# EAGLE design homeboard11 (EAGLE 6.0)
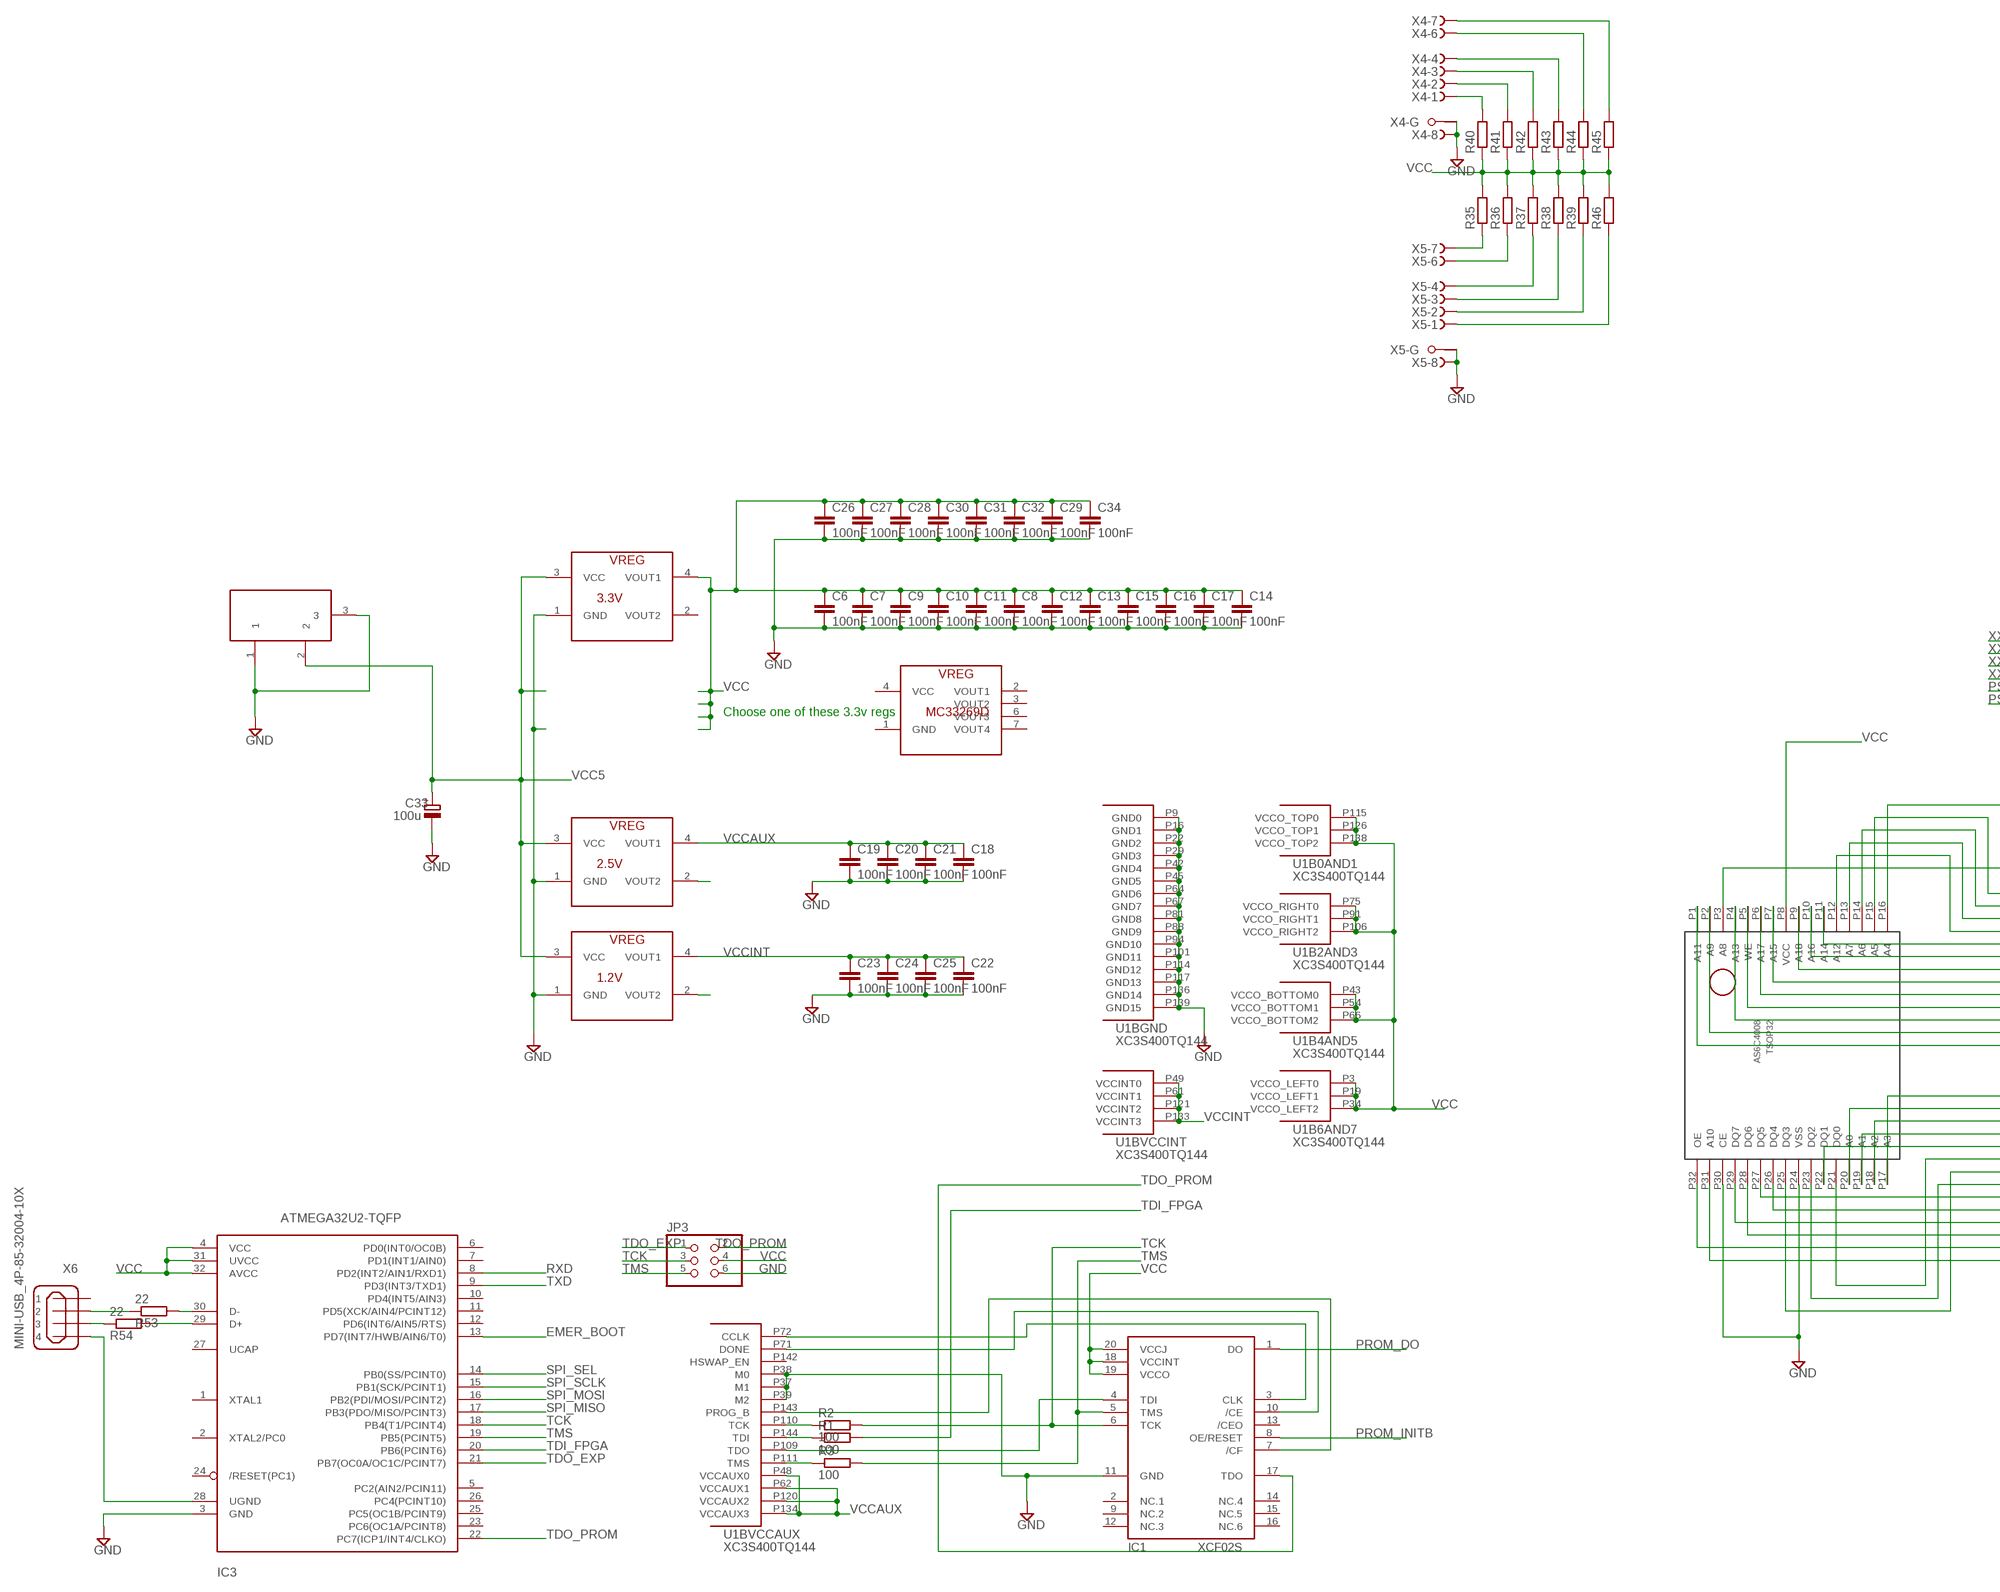
[diagram p0: schematic, sheet 1, part 1 of 3]
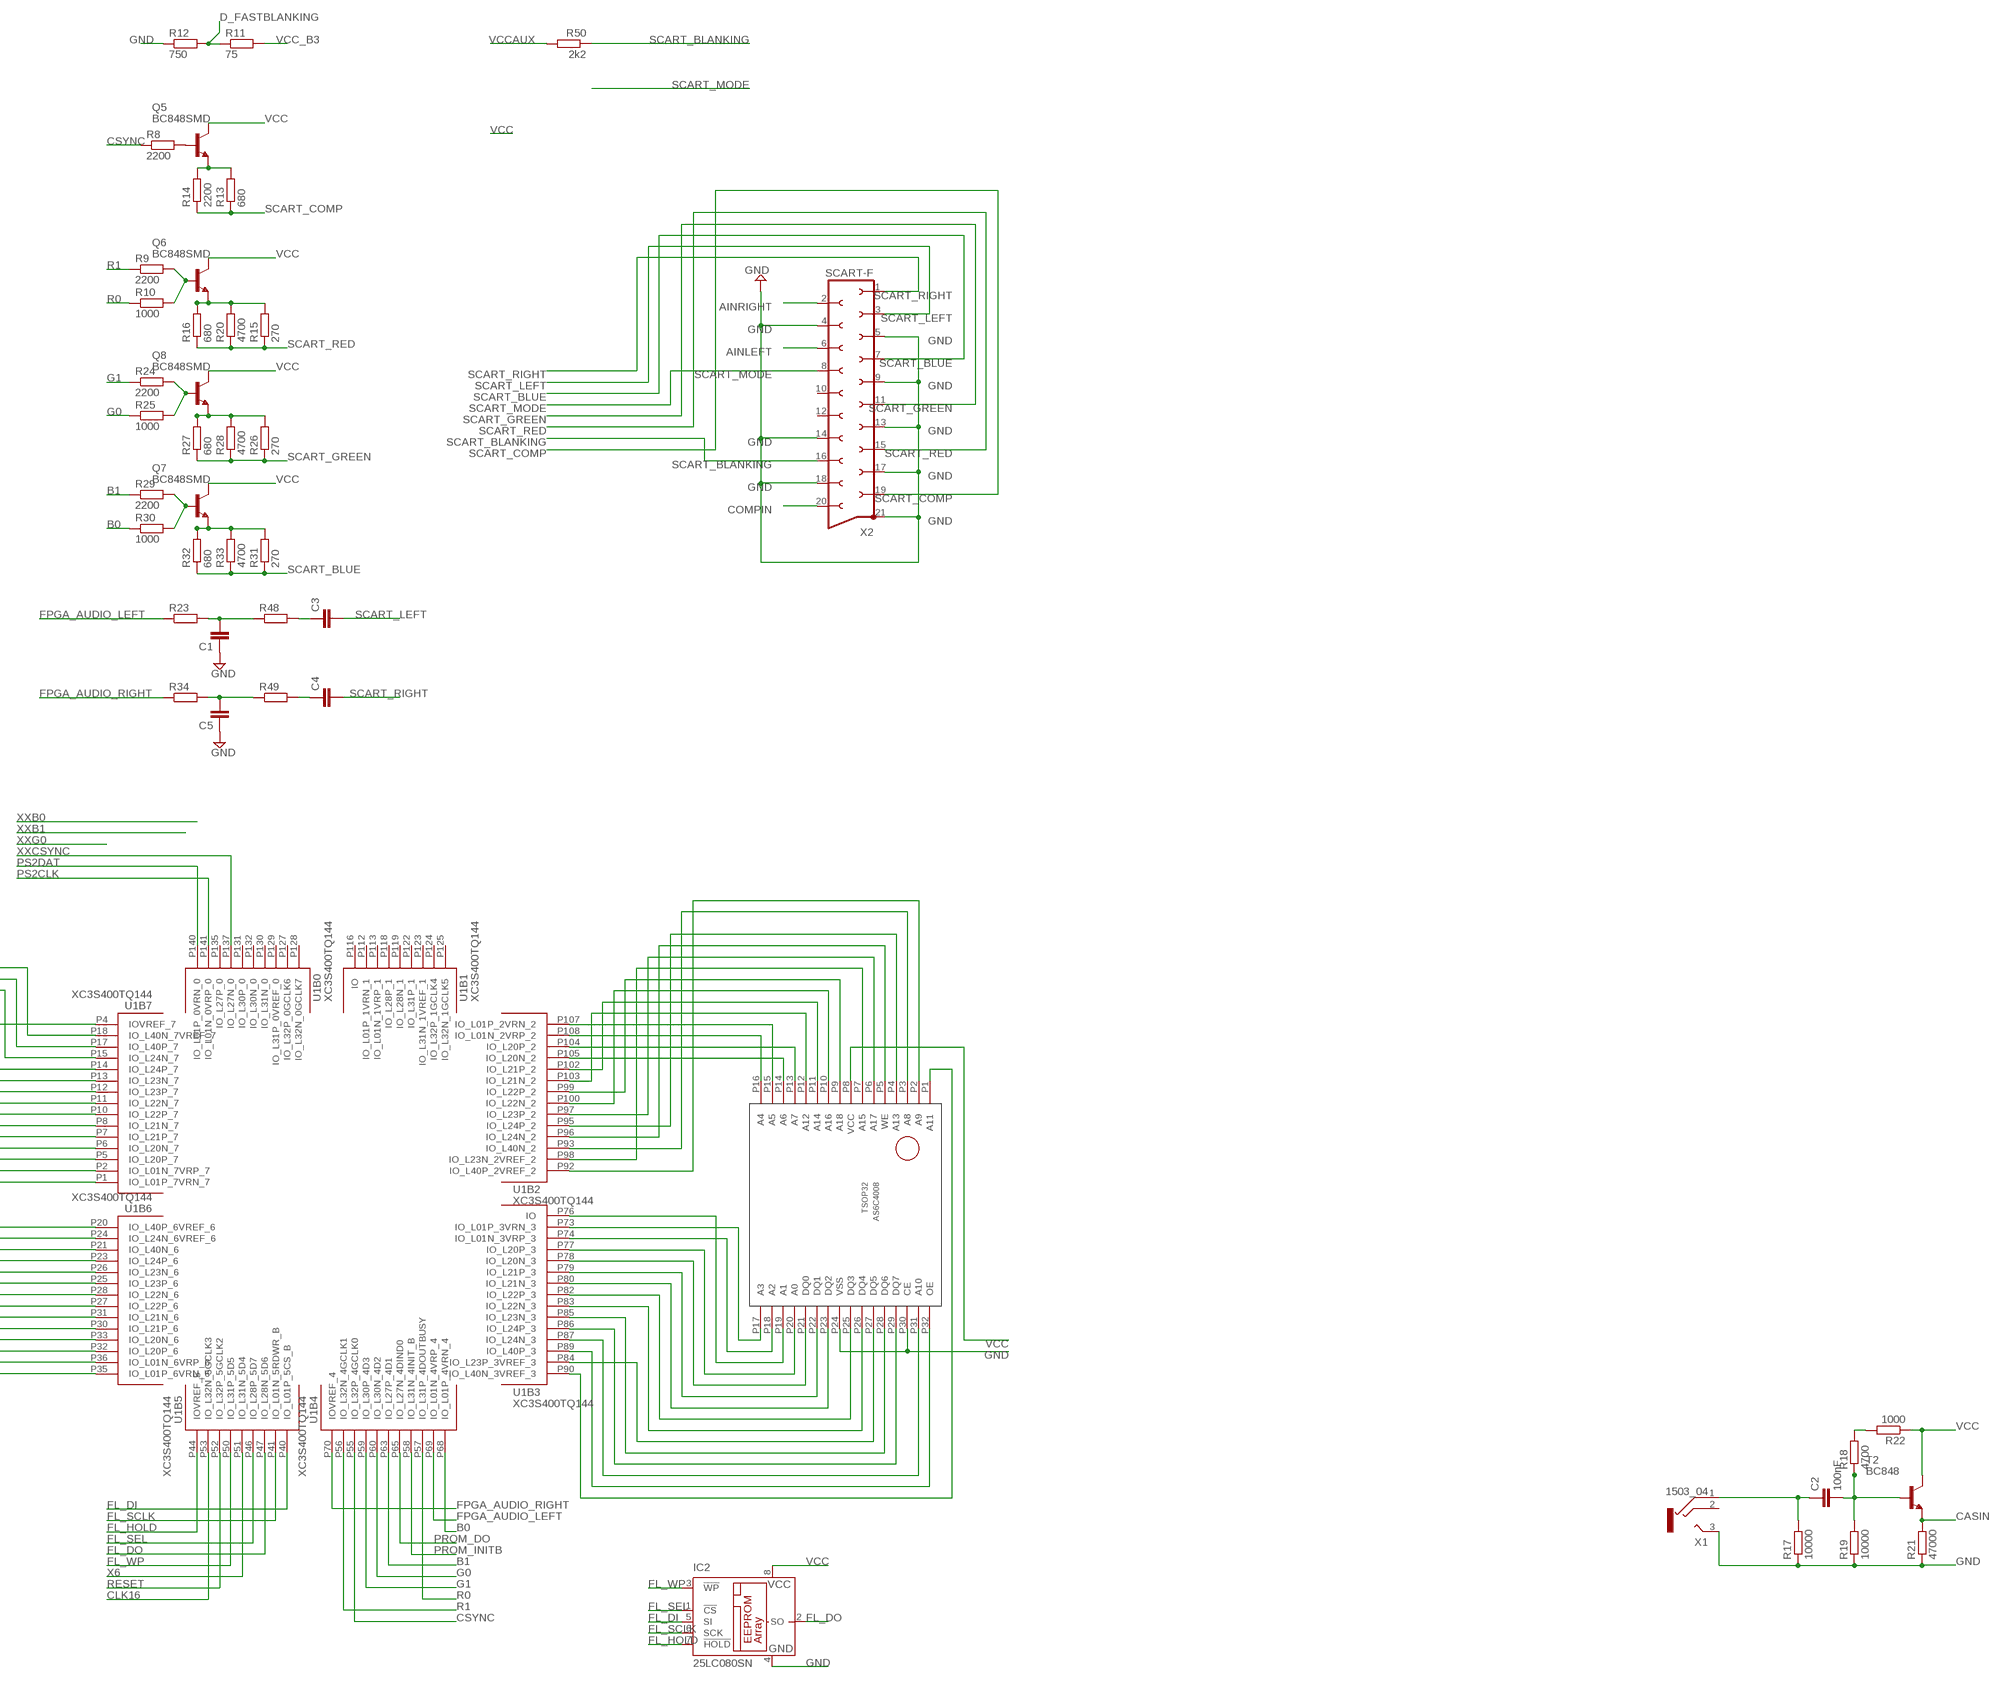
[diagram p1: schematic, sheet 1, part 2 of 3]
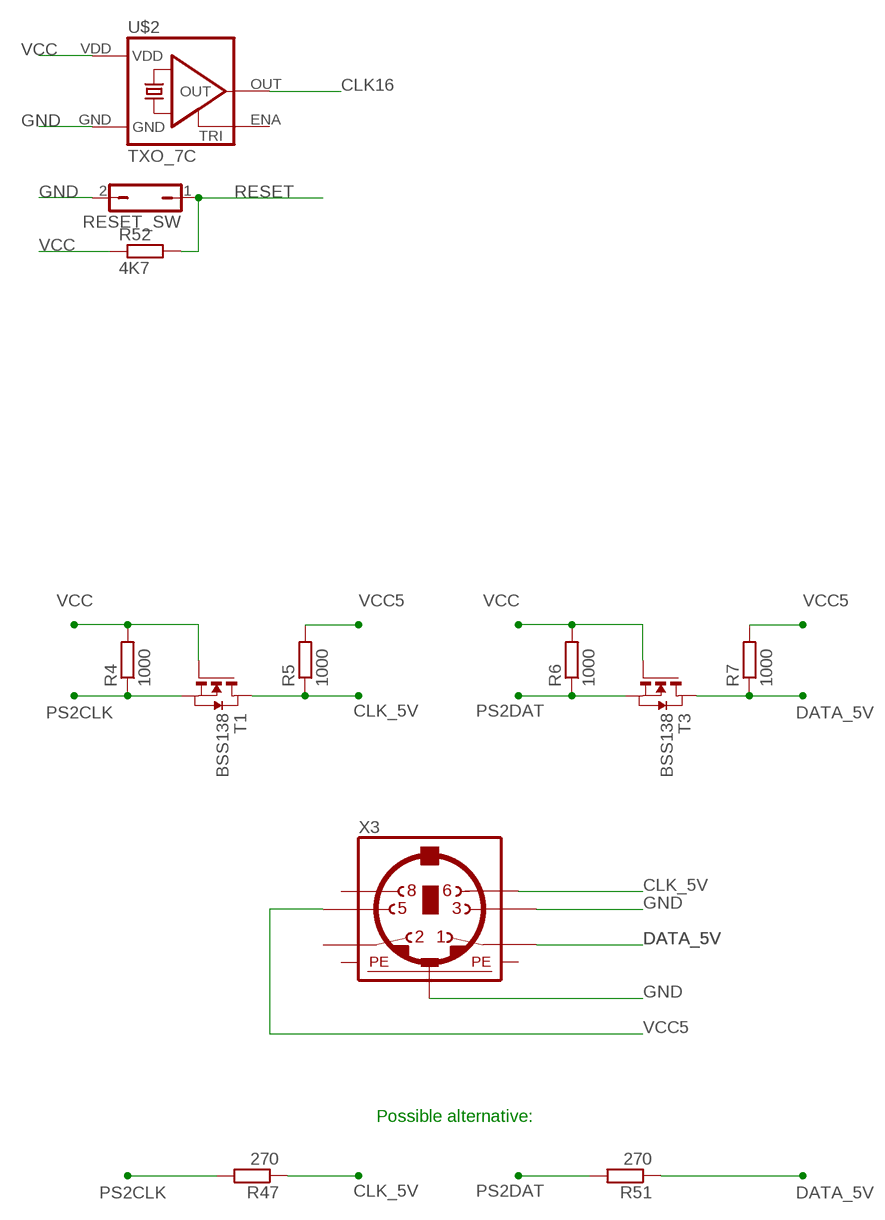
[diagram p2: schematic, sheet 1, part 3 of 3]

## Parts
C1  C-EUC0603  [C0603]
C2  100nF  C-EUC0603  [C0603]
C3  C-EUC0603  [C0603]
C4  C-EUC0603  [C0603]
C5  C-EUC0603  [C0603]
C6  100nF  C-EUC0603  [C0603]
C7  100nF  C-EUC0603  [C0603]
C8  100nF  C-EUC0603  [C0603]
C9  100nF  C-EUC0603  [C0603]
C10  100nF  C-EUC0603  [C0603]
C11  100nF  C-EUC0603  [C0603]
C12  100nF  C-EUC0603  [C0603]
C13  100nF  C-EUC0603  [C0603]
C14  100nF  C-EUC0603  [C0603]
C15  100nF  C-EUC0603  [C0603]
C16  100nF  C-EUC0603  [C0603]
C17  100nF  C-EUC0603  [C0603]
C18  100nF  C-EUC0603  [C0603]
C19  100nF  C-EUC0603  [C0603]
C20  100nF  C-EUC0603  [C0603]
C21  100nF  C-EUC0603  [C0603]
C22  100nF  C-EUC0603  [C0603]
C23  100nF  C-EUC0603  [C0603]
C24  100nF  C-EUC0603  [C0603]
C25  100nF  C-EUC0603  [C0603]
C26  100nF  C-EUC0603  [C0603]
C27  100nF  C-EUC0603  [C0603]
C28  100nF  C-EUC0603  [C0603]
C29  100nF  C-EUC0603  [C0603]
C30  100nF  C-EUC0603  [C0603]
C31  100nF  C-EUC0603  [C0603]
C32  100nF  C-EUC0603  [C0603]
C33  100u  CPOL-EUD  [PANASONIC_D]
C34  100nF  C-EUC0603  [C0603]
IC1  XCF02S  [VO20]
IC2  25LC080SN  [SO-08]
IC3  ATMEGA32U2-TQFP  [TQFP32-08]
JP3  PINHD-2X3  [2X03]
Q5  BC848SMD  [SOT23]
Q6  BC848SMD  [SOT23]
Q7  BC848SMD  [SOT23]
Q8  BC848SMD  [SOT23]
R1  100  R-EU_R0805  [R0805]
R2  100  R-EU_R0805  [R0805]
R3  100  R-EU_R0805  [R0805]
R4  1000  R-EU_R0805  [R0805]
R5  1000  R-EU_R0805  [R0805]
R6  1000  R-EU_R0805  [R0805]
R7  1000  R-EU_R0805  [R0805]
R8  2200  R-EU_R0805  [R0805]
R9  2200  R-EU_R0805  [R0805]
R10  1000  R-EU_R0805  [R0805]
R11  75  R-EU_R0805  [R0805]
R12  750  R-EU_R0805  [R0805]
R13  680  R-EU_R0805  [R0805]
R14  2200  R-EU_R0805  [R0805]
R15  270  R-EU_R0805  [R0805]
R16  680  R-EU_R0805  [R0805]
R17  10000  R-EU_R0805  [R0805]
R18  4700  R-EU_R0805  [R0805]
R19  10000  R-EU_R0805  [R0805]
R20  4700  R-EU_R0805  [R0805]
R21  47000  R-EU_R0805  [R0805]
R22  1000  R-EU_R0805  [R0805]
R23  R-EU_M0805  [M0805]
R24  2200  R-EU_R0805  [R0805]
R25  1000  R-EU_R0805  [R0805]
R26  270  R-EU_R0805  [R0805]
R27  680  R-EU_R0805  [R0805]
R28  4700  R-EU_R0805  [R0805]
R29  2200  R-EU_R0805  [R0805]
R30  1000  R-EU_R0805  [R0805]
R31  270  R-EU_R0805  [R0805]
R32  680  R-EU_R0805  [R0805]
R33  4700  R-EU_R0805  [R0805]
R34  R-EU_M0805  [M0805]
R35  R-EU_M0805  [M0805]
R36  R-EU_M0805  [M0805]
R37  R-EU_M0805  [M0805]
R38  R-EU_M0805  [M0805]
R39  R-EU_M0805  [M0805]
R40  R-EU_M0805  [M0805]
R41  R-EU_M0805  [M0805]
R42  R-EU_M0805  [M0805]
R43  R-EU_M0805  [M0805]
R44  R-EU_M0805  [M0805]
R45  R-EU_M0805  [M0805]
R46  R-EU_M0805  [M0805]
R47  270  R-EU_R0805  [R0805]
R48  R-EU_M0805  [M0805]
R49  R-EU_M0805  [M0805]
R50  2k2  R-EU_M0805  [M0805]
R51  270  R-EU_R0805  [R0805]
R52  4K7  R-EU_M0805  [M0805]
R53  22  R-EU_R0805  [R0805]
R54  22  R-EU_R0805  [R0805]
REG1.2  1.2V  NX1117  [SOT223]
REG2.5  2.5V  NX1117  [SOT223]
RESET_SW  JP1Q  [JP1]
T1  BSS138  NMOSSOT23  [SOT-23]
T2  BC848  [SOT23]
T3  BSS138  NMOSSOT23  [SOT-23]
U1  XC3S400TQ144  [TQ144]
U$1  AS6C4008  [TSOP32]
U$2  TXO_7C  [OSC_7C]
U$4  3.3V  NX1117  [SOT223]
U$5  MC33269D  [SO8]
U$6  AS6C4008  [TSOP32]
X1  1503_04  [1503_04]
X2  SCART-F  [SCART-F]
X3  MINI_DIN_6  [M_DIN6]
X4  F09HPS  [F09HP]
X5  F09HPS  [F09HP]
X6  MINI-USB_4P-85-32004-10X  [85-32004-10X]
X8  DC21MMX  [DC-21MM]

## Nets
AINLEFT: X2.6
AINRIGHT: X2.2
B0: R30.1 U1.P68(B4:IO_L01P_4VRN_4)
B1: R29.1 U1.P63(B4:IO_L27P_4D1)
CASIN: R21.2 T2.2(E)
CLK16: U1.P53(B5:IO_L32N_5GCLK3) U$2.OUT
CLK_5V: R5.1 R47.1 T1.1(D) X3.6
COMPIN: X2.20
CSYNC: R8.1 U1.P55(B4:IO_L32P_4GCLK0)
D_FASTBLANKING: R11.1 R12.2
DATA_5V: R7.1 R51.1 T3.1(D) X3.1
EMER_BOOT: IC3.13(PD7(INT7/HWB/AIN6/T0))
FL_DI: IC2.5(SI) U1.P40(B5:IO_L01P_5CS_B)
FL_DO: IC2.2(SO) U1.P47(B5:IO_L28N_5D6)
FL_HOLD: IC2.7(!HOLD) U1.P44(B5:IOVREF_5)
FL_SCLK: IC2.6(SCK) U1.P41(B5:IO_L01N_5RDWR_B)
FL_SEL: IC2.1(!CS) U1.P46(B5:IO_L28P_5D7)
FL_WP: IC2.3(!WP) U1.P50(B5:IO_L31P_5D5)
FPGA_AUDIO_LEFT: R23.1 U1.P69(B4:IO_L01N_4VRP_4)
FPGA_AUDIO_RIGHT: R34.1 U1.P70(B4:IOVREF_4)
G0: R25.1 U1.P60(B4:IO_L30N_4D2)
G1: R24.1 U1.P59(B4:IO_L30P_4D3)
GND: C1.1 C5.1 C6.2 C7.2 C8.2 C9.2 C10.2 C11.2 C12.2 C13.2 C14.2 C15.2 C16.2 C17.2 C18.2 C19.2 C20.2 C21.2 C22.2 C23.2 C24.2 C25.2 C26.2 C27.2 C28.2 C29.2 C30.2 C31.2 C32.2 C33.- C34.2 IC1.11(GND) IC2.4(GND) IC3.3(GND) JP3.6 R12.1 R17.1 R19.1 R21.1 REG1.2.1(GND) REG2.5.1(GND) RESET_SW.2 U1.P9(BGND:GND0) U1.P16(BGND:GND1) U1.P22(BGND:GND2) U1.P29(BGND:GND3) U1.P37(BVCCAUX:M1) U1.P38(BVCCAUX:M0) U1.P39(BVCCAUX:M2) U1.P42(BGND:GND4) U1.P45(BGND:GND5) U1.P64(BGND:GND6) U1.P67(BGND:GND7) U1.P81(BGND:GND8) U1.P88(BGND:GND9) U1.P94(BGND:GND10) U1.P101(BGND:GND11) U1.P114(BGND:GND12) U1.P117(BGND:GND13) U1.P136(BGND:GND14) U1.P139(BGND:GND15) U$1.P24(VSS) U$1.P30(CE) U$2.GND U$4.1(GND) U$6.P24(VSS) U$6.P30(CE) X1.3 X2.4 X2.5 X2.9 X2.13 X2.14 X2.17 X2.18 X2.21 X3.3 X3.SH2(PE2) X4.8(-8:F) X4.G1(-G:G1) X5.8(-8:F) X5.G1(-G:G1) X8.1 X8.3
N$1: U1.P108(B2:IO_L01N_2VRP_2) U$1.P16(A4)
N$2: U1.P107(B2:IO_L01P_2VRN_2) U$1.P15(A5)
N$3: U1.P105(B2:IO_L20N_2) U$1.P14(A6)
N$4: U1.P104(B2:IO_L20P_2) U$1.P13(A7)
N$5: U1.P103(B2:IO_L21N_2) U$1.P12(A12)
N$6: U1.P102(B2:IO_L21P_2) U$1.P11(A14)
N$7: U1.P100(B2:IO_L22N_2) U$1.P10(A16)
N$8: U1.P99(B2:IO_L22P_2) U$1.P9(A18)
N$9: U1.P98(B2:IO_L23N_2VREF_2) U$1.P7(A15)
N$10: U1.P97(B2:IO_L23P_2) U$1.P6(A17)
N$11: U1.P96(B2:IO_L24N_2) U$1.P5(WE)
N$12: U1.P95(B2:IO_L24P_2) U$1.P4(A13)
N$13: U1.P93(B2:IO_L40N_2) U$1.P3(A8)
N$14: U1.P92(B2:IO_L40P_2VREF_2) U$1.P2(A9)
N$15: U1.P90(B3:IO_L40N_3VREF_3) U$1.P1(A11)
N$16: U1.P73(B3:IO_L01P_3VRN_3) U$1.P17(A3)
N$17: U1.P74(B3:IO_L01N_3VRP_3) U$1.P18(A2)
N$18: U1.P76(B3:IO) U$1.P19(A1)
N$19: U1.P77(B3:IO_L20P_3) U$1.P20(A0)
N$20: U1.P78(B3:IO_L20N_3) U$1.P21(DQ0)
N$21: U1.P79(B3:IO_L21P_3) U$1.P22(DQ1)
N$22: U1.P80(B3:IO_L21N_3) U$1.P23(DQ2)
N$23: U1.P82(B3:IO_L22P_3) U$1.P25(DQ3)
N$24: U1.P83(B3:IO_L22N_3) U$1.P26(DQ4)
N$25: U1.P84(B3:IO_L23P_3VREF_3) U$1.P27(DQ5)
N$26: U1.P85(B3:IO_L23N_3) U$1.P28(DQ6)
N$27: U1.P86(B3:IO_L24P_3) U$1.P29(DQ7)
N$28: U1.P87(B3:IO_L24N_3) U$1.P31(A10)
N$29: U1.P89(B3:IO_L40P_3) U$1.P32(OE)
N$30: R35.1 X5.7(-7:F)
N$31: R36.1 X5.6(-6:F)
N$32: R37.1 X5.4(-4:F)
N$33: R38.1 X5.3(-3:F)
N$34: R39.1 X5.2(-2:F)
N$35: IC1.3(CLK) U1.P72(BVCCAUX:CCLK)
N$36: R53.1 X6.2
N$37: R46.1 X5.1(-1:F)
N$38: IC1.10(/CE) U1.P71(BVCCAUX:DONE)
N$39: R2.1 U1.P110(BVCCAUX:TCK)
N$40: IC1.7(/CF) U1.P143(BVCCAUX:PROG_B)
N$41: R40.2 X4.1(-1:F)
N$42: R1.1 U1.P144(BVCCAUX:TDI)
N$43: R3.1 U1.P111(BVCCAUX:TMS)
N$44: R41.2 X4.2(-2:F)
N$45: R42.2 X4.3(-3:F)
N$46: R43.2 X4.4(-4:F)
N$47: R44.2 X4.6(-6:F)
N$48: R45.2 X4.7(-7:F)
N$49: IC3.29(D+) R54.2
N$50: REG2.5.2(VOUT2)
N$51: C1.2 R23.2 R48.1
N$52: C3.1 R48.2
N$53: Q6.1(B) R9.2 R10.2
N$54: Q6.2(E) R15.2 R16.2 R20.2
N$55: Q8.1(B) R24.2 R25.2
N$56: Q8.2(E) R26.2 R27.2 R28.2
N$57: Q7.1(B) R29.2 R30.2
N$58: Q7.2(E) R31.2 R32.2 R33.2
N$59: Q5.2(E) R13.2 R14.2
N$60: C2.2 R18.1 R19.2 T2.1(B)
N$61: C2.1 R17.2 X1.1
N$62: R18.2 R22.2
N$63: Q5.1(B) R8.2
N$64: C4.1 R49.2
N$65: C5.2 R34.2 R49.1
N$66: R54.1 X6.3
N$67: U1.P1(B7:IO_L01P_7VRN_7) U$6.P1(A11)
N$68: IC3.30(D-) R53.2
N$69: IC3.28(UGND) X6.4
N$70: REG1.2.2(VOUT2)
N$71: U1.P2(B7:IO_L01N_7VRP_7) U$6.P2(A9)
N$72: U1.P4(B7:IOVREF_7) U$6.P3(A8)
N$73: U1.P5(B7:IO_L20P_7) U$6.P4(A13)
N$74: U1.P6(B7:IO_L20N_7) U$6.P5(WE)
N$75: U1.P7(B7:IO_L21P_7) U$6.P6(A17)
N$76: U1.P8(B7:IO_L21N_7) U$6.P7(A15)
N$77: U1.P10(B7:IO_L22P_7) U$6.P9(A18)
N$78: U1.P11(B7:IO_L22N_7) U$6.P10(A16)
N$79: U1.P12(B7:IO_L23P_7) U$6.P11(A14)
N$80: U1.P13(B7:IO_L23N_7) U$6.P12(A12)
N$81: U1.P14(B7:IO_L24P_7) U$6.P13(A7)
N$82: U1.P15(B7:IO_L24N_7) U$6.P14(A6)
N$83: U1.P17(B7:IO_L40P_7) U$6.P15(A5)
N$84: U1.P18(B7:IO_L40N_7VREF_7) U$6.P16(A4)
N$85: U1.P20(B6:IO_L40P_6VREF_6) U$6.P17(A3)
N$86: U1.P21(B6:IO_L40N_6) U$6.P18(A2)
N$87: U1.P23(B6:IO_L24P_6) U$6.P19(A1)
N$88: U1.P24(B6:IO_L24N_6VREF_6) U$6.P20(A0)
N$89: U1.P25(B6:IO_L23P_6) U$6.P21(DQ0)
N$90: U1.P26(B6:IO_L23N_6) U$6.P22(DQ1)
N$91: U1.P27(B6:IO_L22P_6) U$6.P23(DQ2)
N$92: U1.P28(B6:IO_L22N_6) U$6.P25(DQ3)
N$93: U1.P30(B6:IO_L21P_6) U$6.P26(DQ4)
N$94: U1.P31(B6:IO_L21N_6) U$6.P27(DQ5)
N$95: U1.P32(B6:IO_L20P_6) U$6.P28(DQ6)
N$96: U1.P33(B6:IO_L20N_6) U$6.P29(DQ7)
N$97: U1.P35(B6:IO_L01P_6VRN_6) U$6.P31(A10)
N$98: U1.P36(B6:IO_L01N_6VRP_6) U$6.P32(OE)
PROM_DO: IC1.1(DO) U1.P65(B4:IO_L27N_4DIND0)
PROM_INITB: IC1.8(OE/RESET) U1.P58(B4:IO_L31N_4INIT_B)
PS2CLK: R4.1 R47.2 T1.2(S) U1.P141(B0:IO_L01N_0VRP_0)
PS2DAT: R6.1 R51.2 T3.2(S) U1.P140(B0:IO_L01P_0VRN_0)
R0: R10.1 U1.P57(B4:IO_L31P_4DOUTBUSY)
R1: R9.1 U1.P56(B4:IO_L32N_4GCLK1)
RESET: R52.2 RESET_SW.1 U1.P52(B5:IO_L32P_5GCLK2)
RXD: IC3.8(PD2(INT2/AIN1/RXD1))
SCART_BLANKING: R50.1 X2.16
SCART_BLUE: R31.1 R32.1 R33.1 X2.7
SCART_COMP: R13.1 R14.1 X2.19
SCART_GREEN: R26.1 R27.1 R28.1 X2.11
SCART_LEFT: C3.2 X2.3
SCART_MODE: X2.8
SCART_RED: R15.1 R16.1 R20.1 X2.15
SCART_RIGHT: C4.2 X2.1
SPI_MISO: IC3.17(PB3(PDO/MISO/PCINT3))
SPI_MOSI: IC3.16(PB2(PDI/MOSI/PCINT2))
SPI_SCLK: IC3.15(PB1(SCK/PCINT1))
SPI_SEL: IC3.14(PB0(SS/PCINT0))
TCK: IC1.6(TCK) IC3.18(PB4(T1/PCINT4)) JP3.3 R2.2
TDI_FPGA: IC3.20(PB6(PCINT6)) R1.2
TDO_EXP: IC3.21(PB7(OC0A/OC1C/PCINT7)) JP3.1
TDO_FPGA: IC1.4(TDI) U1.P109(BVCCAUX:TDO)
TDO_PROM: IC1.17(TDO) IC3.22(PC7(ICP1/INT4/CLKO)) JP3.2
TMS: IC1.5(TMS) IC3.19(PB5(PCINT5)) JP3.5 R3.2
TXD: IC3.9(PD3(INT3/TXD1))
VCC: C6.1 C7.1 C8.1 C9.1 C10.1 C11.1 C12.1 C13.1 C14.1 C15.1 C16.1 C17.1 C26.1 C27.1 C28.1 C29.1 C30.1 C31.1 C32.1 C34.1 IC1.18(VCCINT) IC1.19(VCCO) IC1.20(VCCJ) IC2.8(VCC) IC3.4(VCC) IC3.31(UVCC) IC3.32(AVCC) JP3.4 Q5.3(C) Q6.3(C) Q7.3(C) Q8.3(C) R4.2 R6.2 R22.1 R35.2 R36.2 R37.2 R38.2 R39.2 R40.1 R41.1 R42.1 R43.1 R44.1 R45.1 R46.2 R52.1 T1.3(G) T2.3(C) T3.3(G) U1.P3(B6AND7:VCCO_LEFT0) U1.P19(B6AND7:VCCO_LEFT1) U1.P34(B6AND7:VCCO_LEFT2) U1.P43(B4AND5:VCCO_BOTTOM0) U1.P54(B4AND5:VCCO_BOTTOM1) U1.P66(B4AND5:VCCO_BOTTOM2) U1.P75(B2AND3:VCCO_RIGHT0) U1.P91(B2AND3:VCCO_RIGHT1) U1.P106(B2AND3:VCCO_RIGHT2) U1.P115(B0AND1:VCCO_TOP0) U1.P126(B0AND1:VCCO_TOP1) U1.P138(B0AND1:VCCO_TOP2) U$1.P8(VCC) U$2.VDD U$4.4(VOUT1) U$6.P8(VCC)
VCC5: C33.+ R5.2 R7.2 REG1.2.3(VCC) REG2.5.3(VCC) U$4.3(VCC) X3.5 X8.2
VCC_B3: R11.2
VCCAUX: C18.1 C19.1 C20.1 C21.1 R50.2 REG2.5.4(VOUT1) U1.P48(BVCCAUX:VCCAUX0) U1.P62(BVCCAUX:VCCAUX1) U1.P120(BVCCAUX:VCCAUX2) U1.P134(BVCCAUX:VCCAUX3)
VCCINT: C22.1 C23.1 C24.1 C25.1 REG1.2.4(VOUT1) U1.P49(BVCCINT:VCCINT0) U1.P61(BVCCINT:VCCINT1) U1.P121(BVCCINT:VCCINT2) U1.P133(BVCCINT:VCCINT3)
X6: U1.P51(B5:IO_L31N_5D4)
XXCSYNC: U1.P137(B0:IO_L27N_0)
Unconnected: IC1.2(NC.1) IC1.9(NC.2) IC1.12(NC.3) IC1.13(/CEO) IC1.14(NC.4) IC1.15(NC.5) IC1.16(NC.6) IC3.1(XTAL1) IC3.2(XTAL2/PC0) IC3.5(PC2(AIN2/PCIN11)) IC3.6(PD0(INT0/OC0B)) IC3.7(PD1(INT1/AIN0)) IC3.10(PD4(INT5/AIN3)) IC3.11(PD5(XCK/AIN4/PCINT12)) IC3.12(PD6(INT6/AIN5/RTS)) IC3.23(PC6(OC1A/PCINT8)) IC3.24(/RESET(PC1)) IC3.25(PC5(OC1B/PCINT9)) IC3.26(PC4(PCINT10)) IC3.27(UCAP) U1.P112(B1:IO_L01P_1VRN_1) U1.P113(B1:IO_L01N_1VRP_1) U1.P116(B1:IO) U1.P118(B1:IO_L28P_1) U1.P119(B1:IO_L28N_1) U1.P122(B1:IO_L31P_1) U1.P123(B1:IO_L31N_1VREF_1) U1.P124(B1:IO_L32P_1GCLK4) U1.P125(B1:IO_L32N_1GCLK5) U1.P127(B0:IO_L32P_0GCLK6) U1.P128(B0:IO_L32N_0GCLK7) U1.P129(B0:IO_L31P_0VREF_0) U1.P130(B0:IO_L31N_0) U1.P131(B0:IO_L30P_0) U1.P132(B0:IO_L30N_0) U1.P135(B0:IO_L27P_0) U1.P142(BVCCAUX:HSWAP_EN) U$2.ENA(TRI) U$4.2(VOUT2) U$5.1(GND) U$5.2(VOUT1) U$5.3(VOUT2) U$5.4(VCC) U$5.6(VOUT3) U$5.7(VOUT4) X1.2 X2.10 X2.12 X3.2 X3.8 X4.5(-5:F) X4.9(-9:F) X4.G2(-G:G2) X5.5(-5:F) X5.9(-9:F) X5.G2(-G:G2) X6.1

## Notes on the sheet
- Choose one of these 3.3v regs
- Possible alternative:

## Power pins joined to a net without a drawn wire
PE1: X3.SH1(PE1)
PE3: X3.SH3(PE3)

## Library data of the parts
C1-C5 = resistor:C-EU: CAPACITOR, European symbol
C6-C32 C34 = rcl:C-EU: CAPACITOR, European symbol
C33 = rcl:CPOL-EU: POLARIZED CAPACITOR, European symbol
IC1 = smd-special:XCF02S
IC2 = microchip:25*: Serial EEPROM 4K/ 8K , SPI bus; MF: MICROCHIP; MPN: 25LC080/SN; OC_FARNELL: 1137302; OC_NEWARK: 96K4092
IC3 = adafruit:ATMEGA32U2: ATmega32u2 Pin compatible with the atmega8u2, atmega16u2 and atmega32u2 8, 16 or 32 K flash, 1K RAM, 512b EEPROM 8 bit and 16 bit timer (5 PWM total) UART, SPI (no I2C!) USB with 4 endpoints, LUFA compatible 22 I/O lines, analog comparator (no ADC!) Comes with DFU bootloader burned in!
JP3 = pinhead:PINHD-2X3: PIN HEADER
Q5-Q8 = bc548:BC848*: NPN Transistor
R1-R22 R24-R33 R47 R51 R53 R54 = rcl:R-EU_: RESISTOR, European symbol
R23 R34-R46 R48-R50 R52 = resistor:R-EU_: RESISTOR, European symbol
REG1.2 REG2.5 U$4 = cpcfpga:NX1117
RESET_SW = jumper:JP1Q: JUMPER
T1 T3 = zetex:NMOSSOT23: MOS FET; OC_FARNELL: unknown; OC_NEWARK: unknown
T2 = transistor:BC848: NPN TRANSISTOR
U1 = xilinx_spartan3_virtex4_and_5:XC3S400TQ144: Xilinx FPGA
U$1 U$6 = cpcfpga:AS6C4008
U$2 = cpcfpga:TXO_7C: TXC crystal oscillator http://www.txccrystal.com/images/pdf/7c.pdf
U$5 = cpcfpga:MC33269D
X1 = con-lumberg:1503_04: Jack connectors according to JISC 6560, 3.5 mm, IP 57 Klinkensteckverbinder nach JISC 6560, 3,5 mm, IP 57 Source: http://www.lumberg.com/Produkte/PDFs/1503_04.pdf; OC_FARNELL: 1216981; OC_NEWARK: unknown
X2 = con-hirschmann:SCART-F: TV SCART CONNECTOR; OC_FARNELL: unknown; OC_NEWARK: unknown
X3 = mini_din:MINI_DIN_6
X4 X5 = con-subd:F09HPS: SUB-D; OC_FARNELL: unknown; OC_NEWARK: unknown
X6 = con-cypressindustries:MINI-USB_4P-: MINI USB 4 Pol. Source: www.cypressindustries.com; OC_FARNELL: unknown; OC_NEWARK: unknown
X8 = powersupply:DC21MM

## Net classes
1 power: width 0.6 mm, drill 1.1 mm, clearance 0.4 mm
2 gnd: width 0.305 mm, drill 0.508 mm, clearance 0.152 mm

## Board
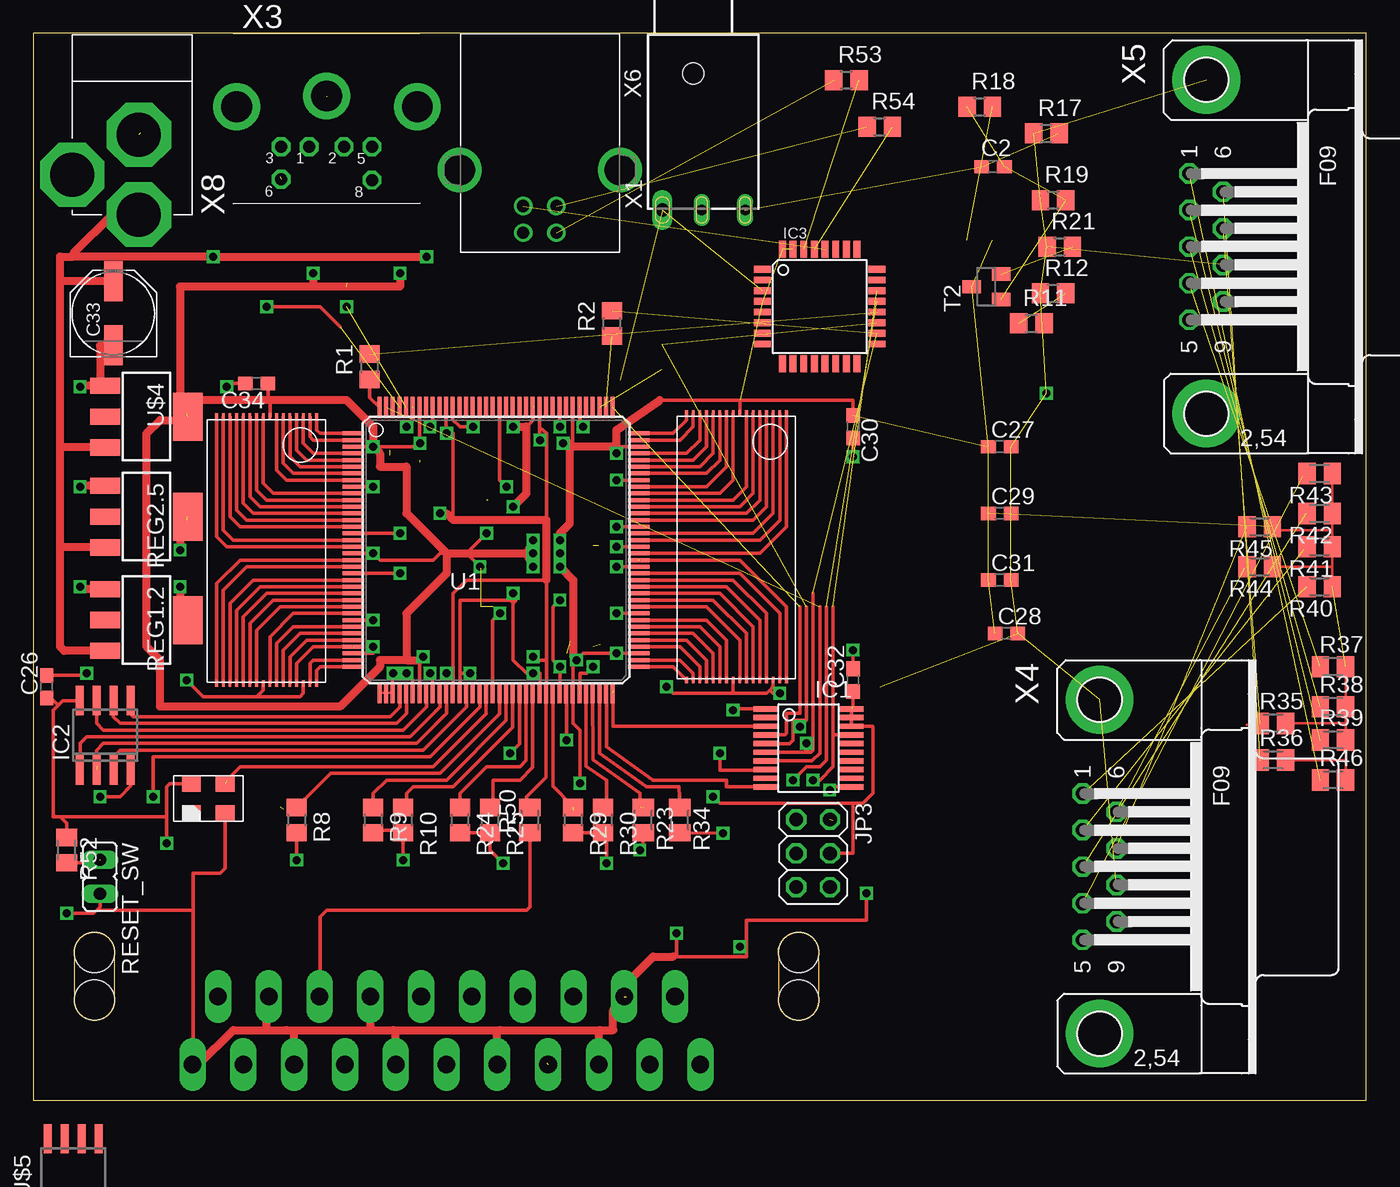
[diagram p3: board, top side]
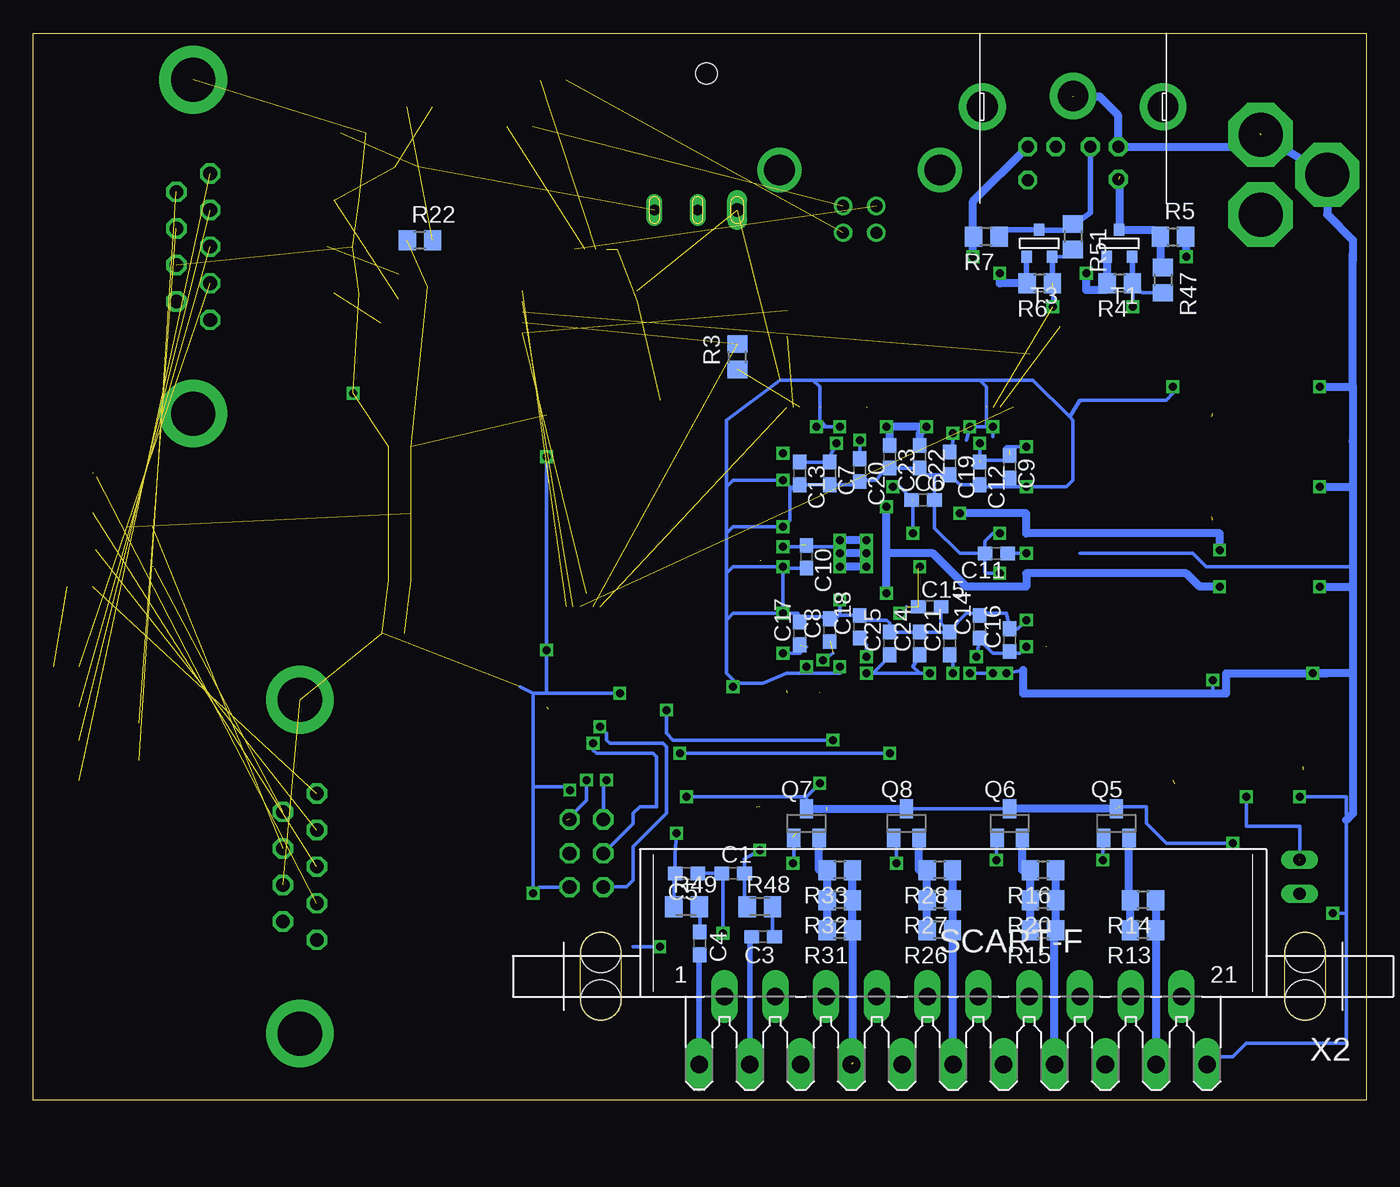
[diagram p4: board, bottom side, seen from below]

Size 100 x 80 mm. Coordinates in mm from the lower left corner, seen from the top.
Outline: 0,0 100,0 100,80 0,80 0,0
Copper layers (1*16): Top 0.0356mm / dielectric 1.5011mm / Bottom 0.0356mm
Design rules: minimum track width 6mil, minimum drill 13mil, track to track 6mil, track to pad 6mil, pad to pad 6mil, via to via 6mil, smd to smd 6mil, copper to edge 15mil, drill to drill 6mil, minimum pad ring 7mil, minimum via ring 7mil, stop-mask expansion 4mil, vias tented up to drill 0mil, thermal gap 10mil

### Footprints (pad centres in the part's own frame; a part is rotated, then mirrored left to right if it is on the bottom)
C0603 = smd 1.1 x 1: 1 -0.85,0; 2 0.85,0
PANASONIC_D = smd 3 x 1.4: + 2.4,0; - -2.4,0
VO20 = smd 0.4 x 1.8: 1 5.85,6.15; 2 5.2,6.15; 3 4.55,6.15; 4 3.9,6.15; 5 3.25,6.15; 6 2.6,6.15; 7 1.95,6.15; 8 1.3,6.15; 9 0.65,6.15; 10 0,6.15; 11 0,-0.3; 12 0.65,-0.3; 13 1.3,-0.3; 14 1.95,-0.3; 15 2.6,-0.3; 16 3.25,-0.3; 17 3.9,-0.3; 18 4.55,-0.3; 19 5.2,-0.3; 20 5.85,-0.3
SO-08 = smd 0.6 x 2.2: 1 -1.905,-2.6; 2 -0.635,-2.6; 3 0.635,-2.6; 4 1.905,-2.6; 5 1.905,2.6; 6 0.635,2.6; 7 -0.635,2.6; 8 -1.905,2.6
TQFP32-08 = smd 1.27 x 0.508: 1 -4.293,2.8; 2 -4.293,2; 3 -4.293,1.2; 4 -4.293,0.4; 5 -4.293,-0.4; 6 -4.293,-1.2; 7 -4.293,-2; 8 -4.293,-2.8; 17 4.293,-2.8; 18 4.293,-2; 19 4.293,-1.2; 20 4.293,-0.4; 21 4.293,0.4; 22 4.293,1.2; 23 4.293,2; 24 4.293,2.8 | smd 0.508 x 1.27: 9 -2.8,-4.293; 10 -2,-4.293; 11 -1.2,-4.293; 12 -0.4,-4.293; 13 0.4,-4.293; 14 1.2,-4.293; 15 2,-4.293; 16 2.8,-4.293; 25 2.8,4.293; 26 2,4.293; 27 1.2,4.293; 28 0.4,4.293; 29 -0.4,4.293; 30 -1.2,4.293; 31 -2,4.293; 32 -2.8,4.293
2X03 = drill 1.016 octagon: 1 -2.54,-1.27; 2 -2.54,1.27; 3 0,-1.27; 4 0,1.27; 5 2.54,-1.27; 6 2.54,1.27
SOT23 = smd 1 x 1.4: 1 -0.95,-1.1; 2 0.95,-1.1; 3 0,1.1
R0805 = smd 1.3 x 1.5: 1 -0.95,0; 2 0.95,0
M0805 = smd 1.3 x 1.6: 1 -0.95,0; 2 0.95,0
SOT223 = smd 1.219 x 2.235: 1 -2.311,-3.099; 2 0,-3.099; 3 2.311,-3.099 | smd 3.6 x 2.2: 4 0,3.099
JP1 = drill 0.914 long: 1 0,-1.27; 2 0,1.27
SOT-23 = smd 0.787 x 0.889: 1 0.025,-1.016; 2 -0.94,1.016; 3 0.991,1.016
TQ144 = smd 1.6 x 0.3: P1 -10.7,8.75; P2 -10.7,8.25; P3 -10.7,7.75; P4 -10.7,7.25; P5 -10.7,6.75; P6 -10.7,6.25; P7 -10.7,5.75; P8 -10.7,5.25; P9 -10.7,4.75; P10 -10.7,4.25; P11 -10.7,3.75; P12 -10.7,3.25; P13 -10.7,2.75; P14 -10.7,2.25; P15 -10.7,1.75; P16 -10.7,1.25; P17 -10.7,0.75; P18 -10.7,0.25; P19 -10.7,-0.25; P20 -10.7,-0.75; P21 -10.7,-1.25; P22 -10.7,-1.75; P23 -10.7,-2.25; P24 -10.7,-2.75; P25 -10.7,-3.25; P26 -10.7,-3.75; P27 -10.7,-4.25; P28 -10.7,-4.75; P29 -10.7,-5.25; P30 -10.7,-5.75; P31 -10.7,-6.25; P32 -10.7,-6.75; P33 -10.7,-7.25; P34 -10.7,-7.75; P35 -10.7,-8.25; P36 -10.7,-8.75; P73 10.7,-8.75; P74 10.7,-8.25; P75 10.7,-7.75; P76 10.7,-7.25; P77 10.7,-6.75; P78 10.7,-6.25; P79 10.7,-5.75; P80 10.7,-5.25; P81 10.7,-4.75; P82 10.7,-4.25; P83 10.7,-3.75; P84 10.7,-3.25; P85 10.7,-2.75; P86 10.7,-2.25; P87 10.7,-1.75; P88 10.7,-1.25; P89 10.7,-0.75; P90 10.7,-0.25; P91 10.7,0.25; P92 10.7,0.75; P93 10.7,1.25; P94 10.7,1.75; P95 10.7,2.25; P96 10.7,2.75; P97 10.7,3.25; P98 10.7,3.75; P99 10.7,4.25; P100 10.7,4.75; P101 10.7,5.25; P102 10.7,5.75; P103 10.7,6.25; P104 10.7,6.75; P105 10.7,7.25; P106 10.7,7.75; P107 10.7,8.25; P108 10.7,8.75 | smd 0.3 x 1.6: P37 -8.75,-10.7; P38 -8.25,-10.7; P39 -7.75,-10.7; P40 -7.25,-10.7; P41 -6.75,-10.7; P42 -6.25,-10.7; P43 -5.75,-10.7; P44 -5.25,-10.7; P45 -4.75,-10.7; P46 -4.25,-10.7; P47 -3.75,-10.7; P48 -3.25,-10.7; P49 -2.75,-10.7; P50 -2.25,-10.7; P51 -1.75,-10.7; P52 -1.25,-10.7; P53 -0.75,-10.7; P54 -0.25,-10.7; P55 0.25,-10.7; P56 0.75,-10.7; P57 1.25,-10.7; P58 1.75,-10.7; P59 2.25,-10.7; P60 2.75,-10.7; P61 3.25,-10.7; P62 3.75,-10.7; P63 4.25,-10.7; P64 4.75,-10.7; P65 5.25,-10.7; P66 5.75,-10.7; P67 6.25,-10.7; P68 6.75,-10.7; P69 7.25,-10.7; P70 7.75,-10.7; P71 8.25,-10.7; P72 8.75,-10.7; P109 8.75,10.7; P110 8.25,10.7; P111 7.75,10.7; P112 7.25,10.7; P113 6.75,10.7; P114 6.25,10.7; P115 5.75,10.7; P116 5.25,10.7; P117 4.75,10.7; P118 4.25,10.7; P119 3.75,10.7; P120 3.25,10.7; P121 2.75,10.7; P122 2.25,10.7; P123 1.75,10.7; P124 1.25,10.7; P125 0.75,10.7; P126 0.25,10.7; P127 -0.25,10.7; P128 -0.75,10.7; P129 -1.25,10.7; P130 -1.75,10.7; P131 -2.25,10.7; P132 -2.75,10.7; P133 -3.25,10.7; P134 -3.75,10.7; P135 -4.25,10.7; P136 -4.75,10.7; P137 -5.25,10.7; P138 -5.75,10.7; P139 -6.25,10.7; P140 -6.75,10.7; P141 -7.25,10.7; P142 -7.75,10.7; P143 -8.25,10.7; P144 -8.75,10.7
TSOP32 = smd 0.5 x 0.2: P1 -9.75,3.75; P2 -9.75,3.25; P3 -9.75,2.75; P4 -9.75,2.25; P5 -9.75,1.75; P6 -9.75,1.25; P7 -9.75,0.75; P8 -9.75,0.25; P9 -9.75,-0.25; P10 -9.75,-0.75; P11 -9.75,-1.25; P12 -9.75,-1.75; P13 -9.75,-2.25; P14 -9.75,-2.75; P15 -9.75,-3.25; P16 -9.75,-3.75; P17 10.25,-3.75; P18 10.25,-3.25; P19 10.25,-2.75; P20 10.25,-2.25; P21 10.25,-1.75; P22 10.25,-1.25; P23 10.25,-0.75; P24 10.25,-0.25; P25 10.25,0.25; P26 10.25,0.75; P27 10.25,1.25; P28 10.25,1.75; P29 10.25,2.25; P30 10.25,2.75; P31 10.25,3.25; P32 10.25,3.75
OSC_7C = smd 1.4 x 1.2: ENA -1.27,-1.1; GND 1.27,-1.1; OUT 1.27,1.1; VDD -1.27,1.1
SO8 = smd 0.6 x 2.2: 1 -1.905,-2.6; 2 -0.635,-2.6; 3 0.635,-2.6; 4 1.905,-2.6; 5 1.905,2.6; 6 0.635,2.6; 7 -0.635,2.6; 8 -1.905,2.6
1503_04 = drill 0.8 pad 1.2 long: 1 3.9,-10.25; 2 0.65,-10.25 | drill 1 pad 1.2 long: 3 -2.3,-10.25 | hole 1.6: 0,0
SCART-F = drill 1.321 long: 1 19.05,5.08; 2 17.145,0; 3 15.24,5.08; 4 13.335,0; 5 11.43,5.08; 6 9.525,0; 7 7.62,5.08; 8 5.715,0; 9 3.81,5.08; 10 1.905,0; 11 0,5.08; 12 -1.905,0; 13 -3.81,5.08; 14 -5.715,0; 15 -7.62,5.08; 16 -9.525,0; 17 -11.43,5.08; 18 -13.335,0; 19 -15.24,5.08; 20 -17.145,0; 21 -19.05,5.08 | hole 3.023: 26.416,0.254; 26.416,-3.302; -26.416,0.254; -26.416,-3.302
M_DIN6 = drill 0.9 pad 1.422 octagon: 1 -1.3,-3.75; 2 1.3,-3.75; 3 -3.4,-3.75; 5 3.4,-3.75; 6 -3.4,-6.2; 8 3.4,-6.25 | drill 2.3 pad 3.5: SH1 6.8,-0.75; SH2 0,0.05; SH3 -6.75,-0.75
F09HP = drill 1.016 octagon: 1 -5.486,-1.27; 2 -2.743,-1.27; 3 0,-1.27; 4 2.743,-1.27; 5 5.486,-1.27; 6 -4.115,1.27; 7 -1.372,1.27; 8 1.372,1.27; 9 4.115,1.27 | drill 3.302 pad 5.08: G1 -12.522,0; G2 12.522,0
85-32004-10X = drill 0.92 pad 1.27: 1 4.71,-1.25; 2 4.71,1.25; 3 2.71,1.25; 4 2.71,-1.25 | drill 2.3 pad 3: M1 0,6.02; M2 0,-6.02
DC-21MM = drill 3.302 pad 4.826 octagon: 1 -5.08,-3.353; 2 -0.076,-6.35; 3 -0.076,-0.356

### Placement (x,y rotation side)
C1  47.5,17 0 bottom
C2  72,70 0 top
C3  45.25,12.25 180 bottom
C4  50,11.75 270 bottom
C5  51,17 180 bottom
C6  33.25,45 0 bottom
C7  40.25,47 270 bottom
C8  40.25,35.25 90 bottom
C9  26.75,47.5 270 bottom
C10  42,40.75 270 bottom
C11  27.75,41 180 bottom
C12  29,47 270 bottom
C13  42.5,47 270 bottom
C14  29,35.5 90 bottom
C15  32.75,37 0 bottom
C16  26.75,34.5 90 bottom
C17  42.5,35 90 bottom
C18  38,35.5 90 bottom
C19  31.25,47.75 270 bottom
C20  38,47.25 270 bottom
C21  31.25,34.25 90 bottom
C22  33.5,48.25 270 bottom
C23  35.75,48.25 270 bottom
C24  33.5,34.25 90 bottom
C25  35.75,34.25 90 bottom
C26  1,31 90 top
C27  72.5,49 0 top
C28  73,35 0 top
C29  72.5,44 0 top
C30  61.5,50.5 270 top
C31  72.5,39 0 top
C32  61.5,31.5 90 top
C33  6,59 90 top
C34  16.75,53.75 180 top
IC1  61.09,23.49 90 top
IC2  5.4,27.36 0 top
IC3  59,59.5 0 top
JP3  58.5,18.5 270 top
Q5  18.75,20.75 0 bottom
Q6  26.75,20.75 0 bottom
Q7  42,20.75 0 bottom
Q8  34.5,20.75 0 bottom
R1  25.25,54.99 90 top
R2  43.42,58.25 90 top
R3  47.18,55.74 90 bottom
R4  18.5,61.25 180 bottom
R5  14.5,64.75 0 bottom
R6  24.5,61.25 180 bottom
R7  28.5,64.75 180 bottom
R8  19.75,21 270 top
R9  25.5,21 270 top
R10  27.75,21 270 top
R11  74.88,58.25 0 top
R12  76.5,60.5 0 top
R13  16.75,12.75 180 bottom
R14  16.75,15 180 bottom
R15  24.25,12.75 180 bottom
R16  24.25,17.25 180 bottom
R17  76,72.5 0 top
R18  71,74.5 0 top
R19  76.5,67.5 0 top
R20  24.25,15 180 bottom
R21  77,64 0 top
R22  71,64.5 0 bottom
R23  45.75,21 270 top
R24  32,21 270 top
R25  34.25,21 270 top
R26  32,12.75 180 bottom
R27  32,15 180 bottom
R28  32,17.25 180 bottom
R29  40.5,21 270 top
R30  42.75,21 270 top
R31  39.5,12.75 180 bottom
R32  39.5,15 180 bottom
R33  39.5,17.25 180 bottom
R34  48.5,21 270 top
R35  93,28.25 0 top
R36  93,25.5 0 top
R37  97.5,32.5 0 top
R38  97.5,29.5 0 top
R39  97.5,27 0 top
R40  96.5,38.5 180 top
R41  96.5,41.5 180 top
R42  96.5,44 180 top
R43  96.5,47 180 top
R44  92,40 180 top
R45  92,43 180 top
R46  97.5,24 0 top
R47  15.25,61.5 270 bottom
R48  45.5,14.5 0 bottom
R49  51,14.5 0 bottom
R50  37.25,21 90 top
R51  22,64.75 270 bottom
R52  2.5,18.75 270 top
R53  61,76.5 0 top
R54  63.5,73 0 top
REG1.2  8.5,36 270 top
REG2.5  8.5,43.75 270 top
RESET_SW  5,16.75 180 top
T1  18.5,64.25 180 bottom
T2  71.5,61 90 top
T3  24.5,64.25 180 bottom
U1  34.72,41.25 0 top
U$1  52.75,41.75 270 top
U$2  13.12,22.62 0 top
U$4  8.5,51.25 270 top
U$5  3,-5.5 0 top
U$6  17.5,41.5 270 top
X1  49.5,77 0 top
X2  31,7.75 180 bottom
X3  22,75.25 0 top
X4  80,17.5 270 top
X5  88,64 270 top
X6  38,69.75 270 top
X8  8,72.75 0 top

### Tracks (layer width: path | path; a pad name or v marks a point on that pad's centre or on a via)
B0
  Top 0.254: U1.P68 41.47,25.03 43,24 43,22.2 R30.1
B1  (1 unrouted)
  Top 0.254: 39.98,22.27 40.5,21.75 | U1.P63 38.98,23.52 40.5,22 R29.1
CASIN  (1 unrouted)
CLK16  (1 unrouted)
  Top 0.254: U1.P53 33.97,28.97 30,25 15.5,25 14.5,24 14.5,23.5
CLK_5V  (1 unrouted)
  Bottom 0.254: 15.5,62.75 15.45,62.8 15.25,62.6 R47.1
  Bottom 0.3: 15.97,65.27 R5.1
  Bottom 0.4: 18.5,65.29 T1.1
  Bottom 0.6: T1.1 15.97,65.27 | R5.1 15.45,62.8 | 18.5,65.29 18.5,69.25
CSYNC
  Top 0.254: U1.P55 34.97,28.97 30.5,24.5 22.3,24.5 R8.1
D_FASTBLANKING  (1 unrouted)
DATA_5V
  Bottom 0.254: R51.1 22.45,65.7 22.5,65.25
  Bottom 0.4: R7.1 27.03,65.27 T3.1 24.51,65.25 22.5,65.25 20.7,66.55 X3.1
FL_DI
  Top 0.254: IC2.5 7.25,29.91 7.25,29 7.5,28.75 26.75,28.75 27.5,29.5 27.5,30.52 U1.P40
FL_DO  (1 unrouted)
  Top 0.254: 4.75,25 4.75,26.25 5.25,26.75 28.75,26.75 31,29 31,30.52 U1.P47
FL_HOLD
  Top 0.254: IC2.7 4.75,28.25 5.25,27.75 27.75,27.75 29.5,29.5 29.5,30.52 U1.P44
FL_SCLK
  Top 0.254: IC2.6 6,29.93 6,28.75 6.5,28.25 27.25,28.25 28,29 28,30.52 U1.P41
FL_SEL
  Top 0.254: IC2.1 3.5,26.75 4,27.25 28.25,27.25 30.5,29.5 30.5,30.52 U1.P46
FL_WP
  Top 0.254: IC2.3 6,25.29 6,25.75 6.5,26.25 29.25,26.25 32.5,29.5 32.5,30.52 U1.P50
FPGA_AUDIO_LEFT  (1 unrouted)
  Top 0.254: 45.5,22 45.5,23 41.98,25.52 U1.P69
FPGA_AUDIO_RIGHT
  Top 0.254: R34.1 48.45,23.5 46,23.5 42.48,26.02 U1.P70
G0
  Top 0.254: U1.P60 37.47,24.97 36.5,24 34.5,24 34.5,22.2 R25.1
G1
  Top 0.254: 32,21.75 R24.1 32,23 34,25 36.5,25 36.97,25.47 U1.P59
GND  (via drill 0.6)  (21 unrouted)
  Top 0.2: U1.P37 U1.P38 U1.P39
  Top 0.254: 17.5,7.75 X2.18 | U$1.P30 55.5,31 55.25,30.75 | 55.25,30.75 55,30.5 52.5,30.5 | 48.25,10.75 53.5,10.75 53.5,11 | 48.25,10.75 48,10.75 | 12,14.25 12,2.75 | 12,14.25 12,17 14,17 14.39,17.39 U$2.GND | IC2.4 7.3,23.55 6.5,22.75 v5,22.75 | 52.5,30.5 48,30.5 v47.5,31 | v48.25,12.5 48.25,10.75 | v56,30.5 55.5,30.5 55.25,30.75 | 4.75,14.25 12,14.25 | 53.5,11 v53,11.5 | 53.5,11 53.5,13.5 62.5,13.5 v62.5,15.5 | IC1.11 59.76,23.49 v59.75,23.25 | 52.5,30.5 U$1.P24 | RESET_SW.2 5,14.5 4.75,14.25 | 4.75,14.25 4.5,14 v2.5,14 | U1.P9 v25.5,46 | U1.P29 v25.5,36 | U1.P22 v27.5,39.5 | U1.P45 29.97,31.97 v29.75,32 | U1.P39 26.97,31.97 v27,32 v28,32 28.47,31.53 U1.P42 | U1.P16 v27.5,42.5 | v28,50.5 28.5,51 28.5,52 | U1.P136 29.97,51.03 v29.75,50.5 | U1.P81 v43.75,36.5 | U1.P88 v43.75,40 | U1.P101 v43.75,46.5 | U1.P94 v43.75,43 | 41,30.57 41,32 41.5,32 v42,32.5 | U1.P64 39.5,30.58 v39.5,32.5 39,33 39,37 v39.5,37.5 | U1.P117 39.47,50.53 v39.5,50.5 | v41.25,50.5 41,50.5 41,52 | C32.2 v61.5,33.75 | C30.2 v61.5,48.25 | C26.2 3.85,31.85 v4,32 | U$6.P24 17.25,30.75 16.75,30.25 | v11.5,31.5 12.75,30.25 16.75,30.25 | U$6.P30 20.25,30.5 20,30.25 16.75,30.25 | C34.2 14.75,53.75 v14.5,53.5
  Top 0.4: X2.21 12.42,2.67 | 25.29,5.46 25.5,5.25
  Top 0.406: 27.19,5.06 27,5.25 | 34.81,5.06 35,5.25 | 19.57,5.18 19.5,5.18 | 19.57,5.11 19.5,5.18 | 42.43,5.18 42.5,5.25 | 19.5,5.18 19,5.18 19,5.25
  Top 0.6: 12.42,2.67 15,5.25 17.5,5.25 | 17.5,5.25 19,5.25 25.5,5.25 27,5.25 35,5.25 42.5,5.25 43.5,5.25 43.5,6.75 44.5,7.75 44.5,8.75 46.5,10.75 48,10.75 | X2.13 27.19,5.06 | X2.9 34.81,5.06 | X2.17 19.57,5.11 | X2.5 42.43,5.18 | X2.14 25.29,5.46 | 17.5,5.25 17.5,7.75 | C33.- 5,56.6 5,53.5 5.4,53.5 U$4.1
  Top 0.61: U$4.1 3.56,53.56 v3.5,53.5 | REG2.5.1 3.56,46.06 v3.5,46 | REG1.2.1 3.69,38.31 v3.5,38.5
  Bottom 0.254: C5.1 C1.1 48.25,17 v48.25,12.5 | v5,22.75 1.5,22.75 1.5,21 1.5,14 | 1.5,14 1.5,4.25 9,4.25 10,3.25 11.37,3.25 X2.21 | v59.75,23.25 59.75,23.5 62.5,23.5 | v53,11.5 55,11.5 | 62.5,23.5 v62.5,15.5 62.04,15.96 JP3.6 | 47.25,31.25 45.25,31.25 43.5,32 42.5,32 | 47.25,31.25 v47.5,31 | 62.5,30.5 63.5,31 | v56,30.5 61.5,30.5 | 61.5,30.5 62.5,30.5 | 62.5,30.5 62.5,23.5 | v2.5,14 1.5,14 | 28,49.75 v28,50.5 28.5,50.5 | 27,46 v25.5,46 22.5,46 22,46.5 22,51 22.25,51.25 | v27,32 25.75,32.25 | v28,32 v29.75,32 | v25.5,36 26.15,35.35 C16.2 27,36.5 29.15,36.5 | C9.2 27,46 | v43.75,36.5 42.65,36.5 C17.2 42.25,36.25 40,36.25 C8.2 39.9,36 39.55,36.35 39.5,36.35 | v43.75,40 43.65,39.9 C10.2 | 43.25,45.75 43.25,43.5 v43.75,43 47.5,43 48,42.5 | 43.25,45.75 43.25,46 v43.75,46.5 47.5,46.5 48,46 | v42,32.5 42.5,32 | v39.5,32.5 39.5,32 42.5,32 | C21.2 C24.2 C25.2 35.75,35.75 36,36 37.65,36 C18.2 39.5,36.35 | v43.75,36.5 v43.75,40 | v39.5,37.5 39.5,36.35 | C15.2 31.9,35.75 C21.2 | C21.2 31.25,35.25 30,36.5 29.15,36.5 | 29.15,36.5 C14.2 | 30,49.5 v29.75,50.5 28.5,50.5 | 38,46.5 36.75,46.5 36.1,47.4 C23.2 C22.2 33,46.9 32.5,46.9 | 38,46.5 38.15,46.5 C20.2 | 32.5,46.9 C19.2 30.5,46.15 C12.2 28.85,46 27,46 | v39.5,50.5 40.5,50.5 | 40.5,50.5 v41.25,50.5 | 38,46.5 38.35,46.15 C7.2 C13.2 42.85,46.15 43.25,45.75 | 32.5,46.9 32.4,46.8 C6.2 32.4,42.9 30.5,41 C11.2 | 22.25,51.25 25,54 29,54 | 29,54 28.5,53.5 28.5,50.5 | 29,54 41.5,54 | 41.5,54 41,53.5 41,51 40.5,50.5 | 41.5,54 44,54 48,51 48,46 | 48,46 48,42.5 | 48,42.5 48,39.5 | 48,39.5 47.5,40 v43.75,40 | 48,39.5 48,36 | 48,36 47.5,36.5 v43.75,36.5 | 48,36 48,32 47.25,31.25 | v27.5,42.5 28,42.5 28.6,41.9 C11.2 | C11.2 28.6,39.6 28.5,39.5 v27.5,39.5
  Bottom 0.254: 61.5,30.5 v61.5,33.75 v61.5,48.25 | v11.5,31.5 11.5,30.5 | v14.5,53.5 14.5,53 15,52.5 21.5,52.5 22.25,51.25 | 1,39.5 1,40 12,40 13,41 21.5,41
  Bottom 0.6: 1,63 1,64.5 2.92,66.42 X8.1 7.42,72.14 X8.3 | 22,75.25 20,75.25 18.6,73.85 X3.3 9,71.5 8,72.5 | 1,49.34 1,49.5 | 25.75,32.25 25.75,30.5 11.5,30.5 10.5,30.5 10.5,32 3,32
  Bottom 0.61: v3.5,53.5 1,53.5 | 1,53.5 1,63 1,63.5 | 1,53.5 1,49.5 1,46 | 1,46 1,39.5 1,38.5 | 1,38.5 1,32 | 1,32 3,32 v4,32 | 1,32 1,21.5 1.5,21 | v3.5,46 1,46 | v3.5,38.5 1,38.5
  other vias: 76,53
N$1
  Top 0.254: U1.P108 48,50 49,51 U$1.P16
N$2
  Top 0.254: U$1.P15 49.5,50.5 48.5,49.5 U1.P107
N$3
  Top 0.254: U$1.P14 50,49.5 49,48.5 U1.P105
N$4
  Top 0.254: U1.P104 49.5,48 50.5,49 U$1.P13
N$5
  Top 0.254: U1.P103 50,47.5 51,48.5 U$1.P12
N$6
  Top 0.254: U$1.P11 51.5,48 50.5,47 U1.P102
N$7
  Top 0.254: U1.P100 50.5,46 52,47.5 U$1.P10
N$8
  Top 0.254: U1.P99 51.5,45.5 52.5,46.5 U$1.P9
N$9
  Top 0.254: U$1.P7 53.5,46 52.5,45 U1.P98
N$10
  Top 0.254: U1.P97 53,44.5 54,45.5 U$1.P6
N$11
  Top 0.254: U$1.P5 54.5,45 53.5,44 U1.P96
N$12
  Top 0.254: U$1.P4 55,44.5 54,43.5 U1.P95
N$13
  Top 0.254: U$1.P3 55.5,44 54,42.5 U1.P93
N$14
  Top 0.254: U$1.P2 56,43.5 54.5,42 U1.P92
N$15
  Top 0.254: U$1.P1 56.5,43 54.5,41 U1.P90
N$16
  Top 0.254: U1.P73 48,32.5 U$1.P17
N$17
  Top 0.254: U1.P74 48.5,33 49.5,32 U$1.P18
N$18
  Top 0.254: U1.P76 48.5,34 50,32.5 U$1.P19
N$19
  Top 0.254: U$1.P20 50.5,33 49,34.5 U1.P77
N$20
  Top 0.254: U1.P78 49.5,35 51,33.5 U$1.P21
N$21
  Top 0.254: U$1.P22 51.5,34 50,35.5 U1.P79
N$22
  Top 0.254: U1.P80 50.5,36 52,34.5 U$1.P23
N$23
  Top 0.254: U$1.P25 53,34.5 50.5,37 U1.P82
N$24
  Top 0.254: U1.P83 51,37.5 53.5,35 U$1.P26
N$25
  Top 0.254: U$1.P27 54,35.5 51.5,38 U1.P84
N$26
  Top 0.254: U1.P85 52,38.5 54.5,36 U$1.P28
N$27
  Top 0.254: U$1.P29 55,36.5 52.5,39 U1.P86
N$28
  Top 0.254: U$1.P31 56,36.5 53,39.5 U1.P87
N$29  (1 unrouted)
  Top 0.254: U$1.P32 56.5,37 53,40.5 45.5,40.5
N$30  (1 unrouted)
  Top 0.2: 91.05,28.13 R35.1
N$31  (1 unrouted)
  Top 0.2: 91.55,25.39 R36.1
N$32  (1 unrouted)
N$33  (1 unrouted)
N$34  (1 unrouted)
  Top 0.2: 96.55,26.88 R39.1
N$35  (1 unrouted)
  Top 0.254: IC1.3 43.5,28.04 43.5,30.75
N$36  (1 unrouted)
N$37  (1 unrouted)
N$38
  Top 0.254: IC1.10 52.01,23.49 52,23.5 52,24 46.5,24 43,26.5 43,30.52 U1.P71
N$39  (1 unrouted)
N$40  (1 unrouted)
  Top 0.254: IC1.7 58.44,25.44 59,26 59,37
N$41  (1 unrouted)
  Top 0.2: 95.54,38.51 R40.2
N$42
  Top 0.254: R1.1 25.25,52.67 U1.P144
N$43  (1 unrouted)
N$44  (1 unrouted)
  Top 0.2: 95.31,41.26 R41.2
N$45  (2 unrouted)
  Top 0.2: 95,44.5 95.5,44
N$46  (2 unrouted)
  Top 0.2: 95.24,46.74 95.5,47
N$47  (2 unrouted)
  Top 0.2: 90.89,39.88 91,40
N$48  (1 unrouted)
N$49  (1 unrouted)
N$50
  Top 0.254: REG2.5.2 5.65,44
N$51  (via drill 0.6)
  Top 0.254: R23.2 45.75,19 v45.5,18.75
  Bottom 0.254: v45.5,18.75 46.65,18.1 C1.2 46.65,14.7 R48.1
N$52
  Bottom 0.254: R48.2 44.55,12.4 C3.1
N$53  (via drill 0.6)
  Top 0.254: v27.75,18 R10.2 27.7,20.05 27.5,20.25 25.7,20.25 R9.2
  Bottom 0.254: v27.75,18 27.75,19.6 Q6.1
N$54
  Bottom 0.6: R15.2 R20.2 R16.2 25.8,17.25 Q6.2
N$55  (via drill 0.6)
  Top 0.254: R24.2 R25.2 34.25,18.75 v35.25,17.75
  Bottom 0.254: v35.25,17.75 35.25,19.45 Q8.1
N$56
  Bottom 0.6: R26.2 R27.2 R28.2 33.55,17.25 Q8.2
N$57  (via drill 0.6)  (1 unrouted)
  Top 0.254: R29.2 R30.2 | v43,17.75 43,19.75
  Bottom 0.254: Q7.1 42.95,17.8 v43,17.75
N$58
  Bottom 0.6: R31.2 R32.2 R33.2 41.05,17.25 Q7.2
N$59
  Bottom 0.6: R13.2 R14.2 17.8,15 Q5.2
N$60  (3 unrouted)
N$61  (2 unrouted)
N$62  (1 unrouted)
N$63  (via drill 0.6)
  Top 0.254: R8.2 v19.75,18
  Bottom 0.254: v19.75,18 19.75,19.6 Q5.1
N$64
  Bottom 0.254: C4.1 50,14.45 R49.2
N$65  (via drill 0.6)
  Top 0.254: v51.75,20 R34.2
  Bottom 0.254: v51.75,20 51.85,18.4 C5.2 51.95,16.9 R49.1
N$66  (1 unrouted)
N$67
  Top 0.254: U$6.P1 21.25,50.25 21.5,50 U1.P1
N$68  (1 unrouted)
N$69  (1 unrouted)
N$71
  Top 0.254: U$6.P2 20.75,49.75 21,49.5 U1.P2
N$72
  Top 0.254: U$6.P3 20.25,49.25 21,48.5 U1.P4
N$73
  Top 0.254: U$6.P4 19.75,48.75 20.5,48 U1.P5
N$74
  Top 0.254: U$6.P5 19.25,48.25 20,47.5 U1.P6
N$75
  Top 0.254: U$6.P6 18.75,47.75 19.5,47 U1.P7
N$76
  Top 0.254: U$6.P7 18.25,47.25 19,46.5 U1.P8
N$77
  Top 0.254: U$6.P9 17.25,46.25 18,45.5 U1.P10
N$78
  Top 0.254: U$6.P10 16.75,45.75 17.5,45 U1.P11
N$79
  Top 0.254: U$6.P11 16.25,45.25 17,44.5 U1.P12
N$80
  Top 0.254: U$6.P12 15.75,44.75 16.5,44 U1.P13
N$81
  Top 0.254: U$6.P13 15.25,44.25 16,43.5 U1.P14
N$82
  Top 0.254: U$6.P14 14.75,43.75 15.5,43 U1.P15
N$83
  Top 0.254: U$6.P15 14.25,42.75 15,42 U1.P17
N$84
  Top 0.254: U$6.P16 13.75,42.25 14.5,41.5 U1.P18
N$85
  Top 0.254: U$6.P17 13.75,38.75 15.5,40.5 U1.P20
N$86
  Top 0.254: U$6.P18 14.25,38.25 16,40 U1.P21
N$87
  Top 0.254: U$6.P19 14.75,37.25 16.5,39 U1.P23
N$88
  Top 0.254: U$6.P20 15.25,36.75 17,38.5 U1.P24
N$89
  Top 0.254: U$6.P21 15.75,36.25 17.5,38 U1.P25
N$90
  Top 0.254: U$6.P22 16.25,35.75 18,37.5 U1.P26
N$91
  Top 0.254: U$6.P23 16.75,35.25 18.5,37 U1.P27
N$92
  Top 0.254: U$6.P25 17.75,34.75 19.5,36.5 U1.P28
N$93
  Top 0.254: U$6.P26 18.25,34.25 19.5,35.5 U1.P30
N$94
  Top 0.254: U$6.P27 18.75,33.75 20,35 U1.P31
N$95
  Top 0.254: U$6.P28 19.25,33.25 20.5,34.5 U1.P32
N$96  (1 unrouted)
  Top 0.254: U$6.P29 19.75,32.75 21,34 24,34
N$97
  Top 0.254: U$6.P31 20.75,32.75 21,33 U1.P35
N$98
  Top 0.254: U$6.P32 21.25,32.25 21.5,32.5 U1.P36
PROM_DO  (via drill 0.6)
  Top 0.254: 55,29.34 IC1.1 52.66,29.34 v52.5,29.25 | v40,27 40,30.52 U1.P65
  Bottom 0.254: v40,27 52,27 52.5,27.5 v52.5,29.25
PROM_INITB  (via drill 0.6)
  Top 0.254: v35.75,26 36.48,26.73 U1.P58 | v51.5,26 51.5,24.75 54.91,24.75 IC1.8
  Bottom 0.254: v35.75,26 v51.5,26
PS2CLK  (via drill 0.6)  (1 unrouted)
  Top 0.254: 23,58 21.5,59.5 v17.5,59.5
  Bottom 0.254: R47.2 16.85,60.55 R4.1 17.5,61.2 v17.5,59.5
  Bottom 0.4: T1.2 R4.1
PS2DAT  (via drill 0.6)  (2 unrouted)
  Bottom 0.254: 22.57,63.23 R51.2 22,63.5 22.27,63.23 T3.2 | v23.5,59.5 23.5,61
  Bottom 0.4: R6.1 T3.2
R0
  Top 0.254: U1.P57 35.97,27.97 31.5,23.5 28.5,23.5 28,23 28,22.2 R10.1
R1
  Top 0.254: U1.P56 35.47,28.47 31,24 26.5,24 25.5,23 R9.1
RESET  (via drill 0.6)  (1 unrouted)
  Top 0.254: v9,22.75 9,25.75 29.75,25.75 33.5,29.5 33.5,30.52 U1.P52 | R52.2 4.8,17.8 5,18
  Bottom 0.254: v9,22.75 9,20.52 5,20.52 RESET_SW.1
SCART_BLANKING
  Top 0.254: R50.1 37.25,14.5 37,14.25 22,14.25 21.5,13.75 21.5,7.78 X2.16
SCART_BLUE  (1 unrouted)
  Bottom 0.6: R33.1 R32.1 R31.1 38.5,12.75 38.5,2.79
SCART_COMP
  Bottom 0.6: R14.1 R13.1 | X2.19 15.76,12.75 R13.1 | 16,12.75 R13.1
SCART_GREEN
  Bottom 0.6: R28.1 R27.1 R26.1 31,12.75 X2.11
SCART_LEFT
  Bottom 0.2: 46.24,11.91 C3.2
  Bottom 0.4: X2.3 46.24,11.91
SCART_RED
  Bottom 0.6: R16.1 R20.1 R15.1 23.38,12.75 X2.15
SCART_RIGHT
  Bottom 0.254: 50.05,10.6 50,10.6 C4.2
  Bottom 0.4: X2.1 50.05,10.6
TCK  (via drill 0.6)  (2 unrouted)
  Top 0.254: 58.5,38 58.5,26.25 58.34,26.09 58.25,26.09 | 57.84,26.09 58,26.25 | 58,26.25 v58,26.75 | IC1.6 58.25,26.09 | 58,26.25 58.09,26.25 58.25,26.09
  Bottom 0.254: v58,26.75 58,26.25 57.75,26 53.5,26 53.25,25.75 53.25,22 54.5,22 55,21.5 55,20.73 JP3.3
TDI_FPGA  (1 unrouted)
TDO_EXP  (via drill 0.6)  (1 unrouted)
  Top 0.254: v57,24 58,25 59,25 59.5,25.5 59.5,37
  Bottom 0.254: JP3.1 57.23,23.77 v57,24
TDO_FPGA  (1 unrouted)
  Top 0.254: 57.5,37 57.5,29 56.5,29 56.5,27.5 56.39,27.39 IC1.4
TDO_PROM  (via drill 0.6)  (2 unrouted)
  Top 0.254: IC1.17 60.11,27.39 60,27.5 | 60,27.5 60,25 59,24 v58.5,24 | 60,27.5 60,37
  Bottom 0.254: v58.5,24 58.5,22.5 60,21
TMS  (via drill 0.6)  (2 unrouted)
  Top 0.254: 58,37 58,28.5 57,28.5 | IC1.5 56.74,26.74 57,27 57,28.5 | 57,28.5 v57.5,28
  Bottom 0.254: v57.5,28 57,27.5 57,27 56.75,26.75 52.75,26.75 52.5,26.5 52.5,21.5 55,19 55,16.5 55.5,16 57.19,16 JP3.5
VCC  (via drill 0.6)  (22 unrouted)
  Top 0.2: R46.2 98.45,25.5 | 98.45,25.5 R39.2 98.45,28.25 | 98.45,28.25 R38.2 R37.2 | R35.2 98.45,28.25 | R36.2 98.45,25.5 | R40.1 97.45,40 | 97.45,40 R41.1 97.45,42.62 | 97.45,42.62 R42.1 R43.1 | R44.1 97.45,40 | R45.1 93.38,43 93.62,42.75 97.33,42.75 97.45,42.62
  Top 0.254: IC1.20 IC1.19 IC1.18 62.96,28.04 63,28 63,23 62.25,22.25 61.5,22.25 | v41,23.75 41,27.75 40.5,28.25 40.5,30.52 U1.P66 40.5,30.58 40.5,33 v40.75,33 41.25,33.5 v43.75,33.5 U1.P75 | IC2.8 2.21,29.96 1.88,29.62 | 1.88,29.62 1.5,29.25 1.5,21.25 2,21.25 | 2,21.25 10,21.25 | 61.5,22.25 51.5,22.25 v51,22.75 | JP3.4 61.5,18.5 61.5,22.25 | R52.1 2.5,20.75 2,21.25 | U$2.VDD 10.22,23.73 10,23.5 10,21.25 | 10,21.25 v10,19.25 | U1.P19 v25.5,41 26,40.5 30,40.5 30.5,41 31,41 | U1.P3 v25.5,49 | U1.P138 28.97,49.78 v29,49.25 28.75,49 v25.5,49 | U1.P91 v43.75,41.5 | U1.P126 34.97,46.47 v35.5,46 | 25.75,49.25 v25.5,49 | v34,42.5 32.5,41 v33.5,40 | U1.P54 34.47,35.97 v35,36.5 | U1.P106 43.5,49 | C32.1 61.5,29.5 | C30.1 61.5,52.5 53,52.5 | 53,52.5 47,52.5 | U$1.P8 53,52.5 | C26.1 1.35,30.15 1.88,29.62 | U1.P43 28.97,33 28.97,33.22 v29.25,33.25 | U1.P34 25.5,33.5 v25.5,34 | v39.75,49.25 40.5,49 40.47,49.03 U1.P115 | U$6.P8 17.75,52.25 17.5,52.5 17.6,52.6 C34.1
  Top 0.6: 31,41 28,44 28,47.5 26,47.5 26,48.5 v25.5,49 25.5,50.5 23.5,52.5 17.5,52.5 12,52.5 11.5,52 | 31,41 31,39.5 28,36.5 28,33 | 31,41 32.5,41 37,41 | 37,41 v37.5,41 | v37.5,42 37,41 | v37.5,40 37,41 | v39.75,49.25 40.25,49.25 40.25,43.25 39.5,42.5 v39.5,42 v39.5,41 v39.5,40 40.5,39 40.5,33.25 v40.75,33 | v43.75,48.5 43.75,49 | 43.75,49 43.75,50.25 47,52.5 | 43.75,49 43.5,49 40.5,49 | 28,33 26,33 26,32.5 23,29.5 9.5,29.5 9.5,33 8.5,34 8.5,50 9.5,51 11,51 11.5,51.5 | 28,33 28.97,33 | 11.6,50.5 U$4.4 11.6,52.5 11,52.5 11,61 21,61 | v27.5,62 27.5,61 21,61 | v21,62 21,61
  Bottom 0.2: 19.45,60.8 19.05,60.8 19,60.75
  Bottom 0.254: 26.5,21.75 26.6,21.85 Q6.3 Q8.3 | Q7.3 42,22.75 | v41,23.75 42,22.75 | v10,19.25 15,19.25 16.5,20.75 16.5,22 18.5,22 | v51,22.75 42,22.75 | v25.5,49 27,49 26.75,48.75 | 43.6,48.65 v43.75,48.5 | v43.75,33.5 42.5,33.5 42,34 | v40.75,33 40,33.5 | 34.5,37 v35,36.5 | v29,49.25 29,48 27.1,48 27.1,48.9 | v39.75,49.25 40.25,48.25 40.5,48 40.35,47.85 C7.1 C13.1 | v35.5,46 35,46 34,45 v34,42.5 | 33.6,39.9 v33.5,40 | v39.5,41 39.5,41.5 42.5,41.5 | 42.5,41.5 v43.75,41.5 | 42.4,41.6 42.5,41.5 | v29.25,33.25 C14.1 29,34.5 28,33.5 26.9,33.5 C16.1 26.6,33.5 26,33.5 v25.5,34 | C11.1 v25.5,41
  Bottom 0.4: T3.3 25.49,61.29 R6.2 | R4.2 19.45,60.8 19.5,60.75
  Bottom 0.6: Q5.3 26.5,21.85 26.5,21.75 | Q7.3 Q8.3 | v37.5,41 v39.5,41 | v37.5,40 v39.5,40 v39.5,42 v37.5,42 | R6.2 27.5,61.25 v27.5,62 | 19.5,60.75 21,60.75 v21,62 | T1.3 19.45,63.23 R4.2
VCC5  (via drill 0.6)
  Top 0.6: v29.5,63.25 v13.5,63.25 3,63.25 | X8.2 5.9,66.4 3,63.5 3,63.25 | C33.+ 2,61.4 2,61.5 | 2,63.25 3,63.25
  Top 0.61: U$4.3 2.06,48.94 | 2.06,48.94 2,49 2,61.5 2,63.25 | 2.06,48.94 2,48.88 2,41.5 | REG2.5.3 2.06,41.44 2,41.5 | REG1.2.3 2.31,33.69 2,34 2,41.5
  Bottom 0.4: 29.5,64.8 R7.2 29.5,64.75 | 13.55,63.3 v13.5,63.25
  Bottom 0.6: v29.5,63.25 29.5,64.75 | R5.2 13.55,63.3 | 29.5,64.8 29.5,67.4 X3.5
VCCAUX  (via drill 0.6)  (1 unrouted)
  Top 0.254: 31.5,32 v31,32 | 38.5,33 38.5,30.58 U1.P62 38.48,24.23 37,22.75 37,22.25 | 38.5,33 38.5,39 32.5,39 31.5,38 31.5,32 | U1.P48 31.5,30.58 31.5,32 | v37.5,33.25 38,33 38.5,33 | U1.P134 30.97,50.5 | 30.97,50.5 30.97,50.28 v31,50 | U1.P120 37.97,50.47 | 37.97,50.47 38.5,50 38.5,43.5 | 30.97,50.5 31.47,50 31.5,50 31.5,43.5 | 37.97,50.47 37.97,49.53 v38,49.5 | 37,21.75 37,22.25 | R50.2 37.25,22 37,22.25
  Top 0.6: 38.5,39 38.5,43.5 31.5,43.5 31,44 v30.5,44 | 11.5,43.5 11,43 v11,41.25
  Bottom 0.254: C21.1 31,32.9 v31,32 | C18.1 37.5,34.15 v37.5,33.25 | C19.1 31,49.35 v31,50 | 38,48 C20.1 v38,49.5
  Bottom 0.6: v11,41.25 11,42.5 25.5,42.5 25.5,44 v30.5,44
VCCINT  (via drill 0.6)  (1 unrouted)
  Top 0.254: U1.P61 38,30.58 38,32 v37.5,32 37,32 36,33 36,37.5 32,37.5 32,32 | U1.P49 32,30.58 32,32 | 32,32 v32.75,32 | U1.P133 31.47,51.03 32,50.5 v33,50.5 | 37,50.5 37.5,51 37.5,52
  Top 0.6: v36,50.5 37,50.5 37,45.5 v36,44.5 | 36,37.5 v36,38 | v11,38.5 11,36.6 REG1.2.4
  Bottom 0.254: v37.5,32 37,32 | v32.75,32 33.5,32 | 37,32 36.25,32.75 C25.1 | 33.5,32 37,32 | 33.5,32 34,32.5 C24.1 | 35.75,50.25 v36,50.5
  Bottom 0.6: v36,50.5 v33,50.5 33.5,50 C22.1 | C23.1 35.75,50.25 | v36,38 36,41 | 36,41 v36,44.5 | v11,38.5 12.5,38.5 13.5,39.5 25.5,39.5 25.5,38.5 30,38.5 32.5,41 36,41